# EAGLE design tsc_project (EAGLE 9.7.0)
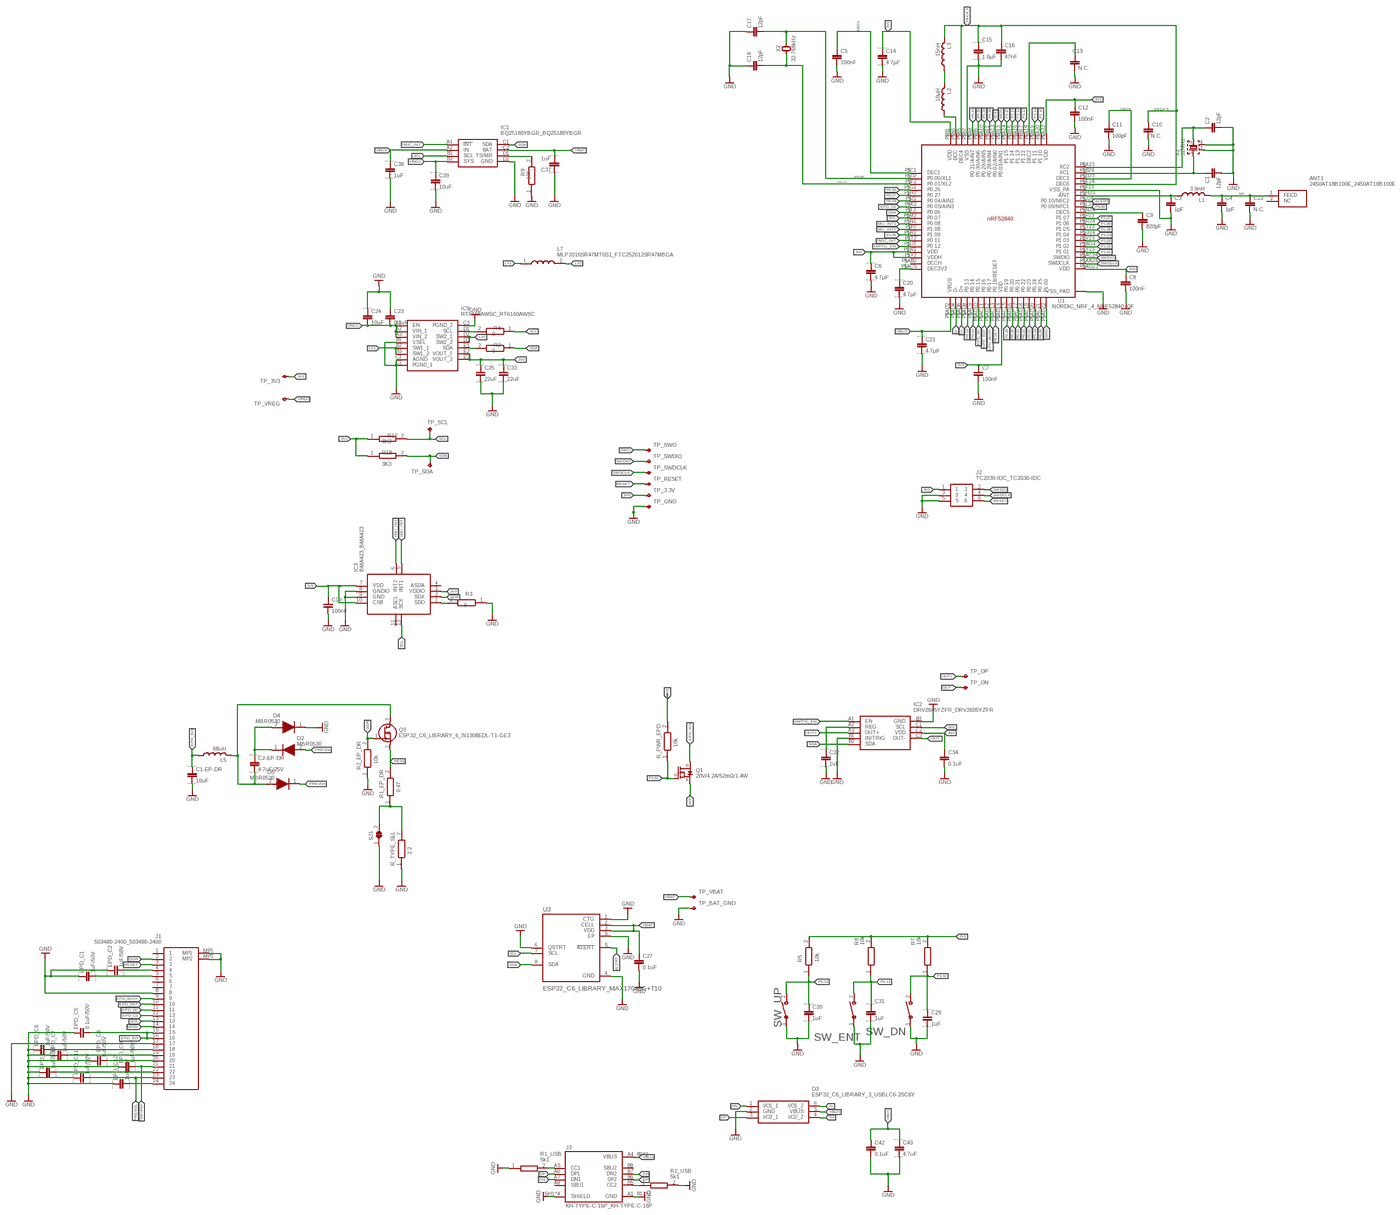
[diagram p0: schematic, sheet 1, overview]
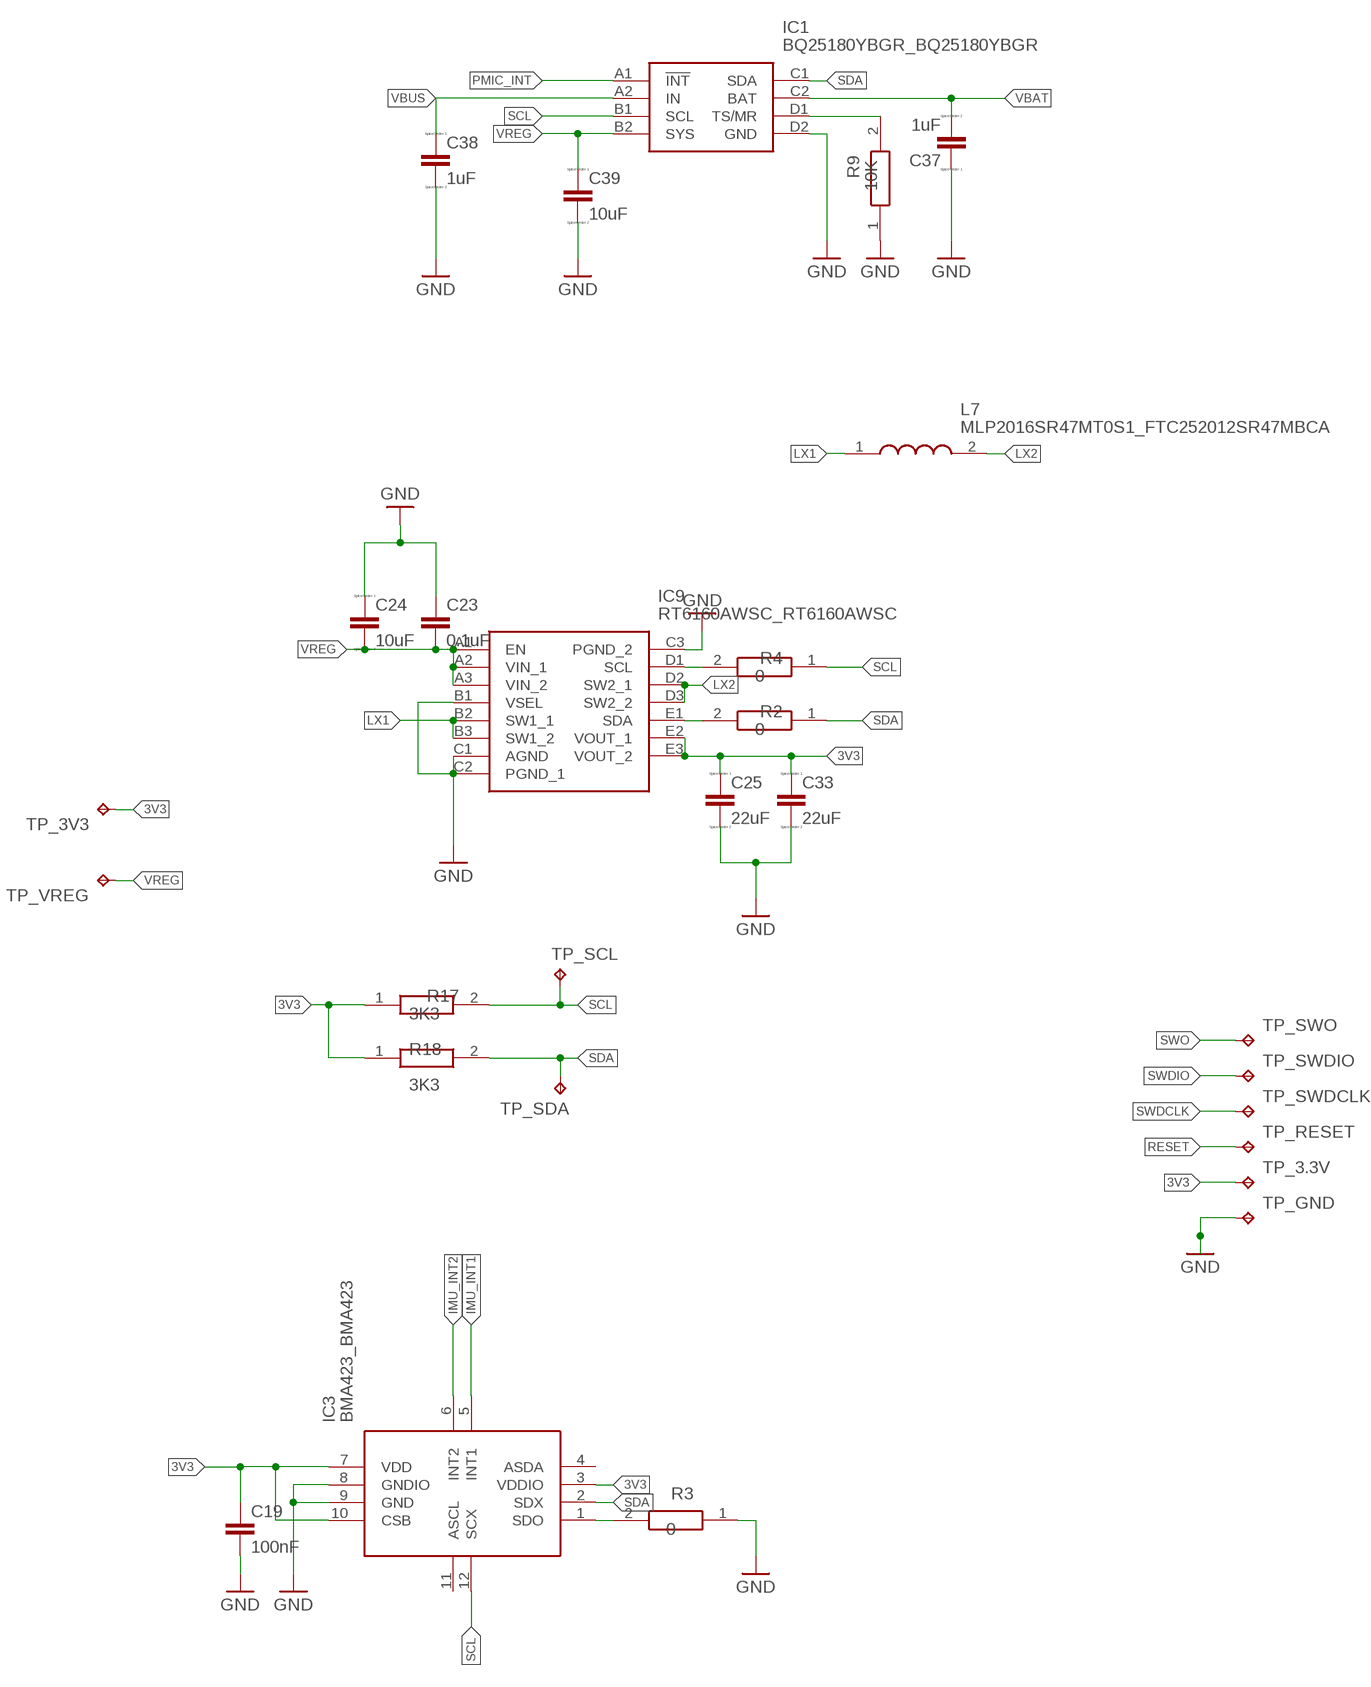
[diagram p1: schematic, sheet 1, part 1 of 4]
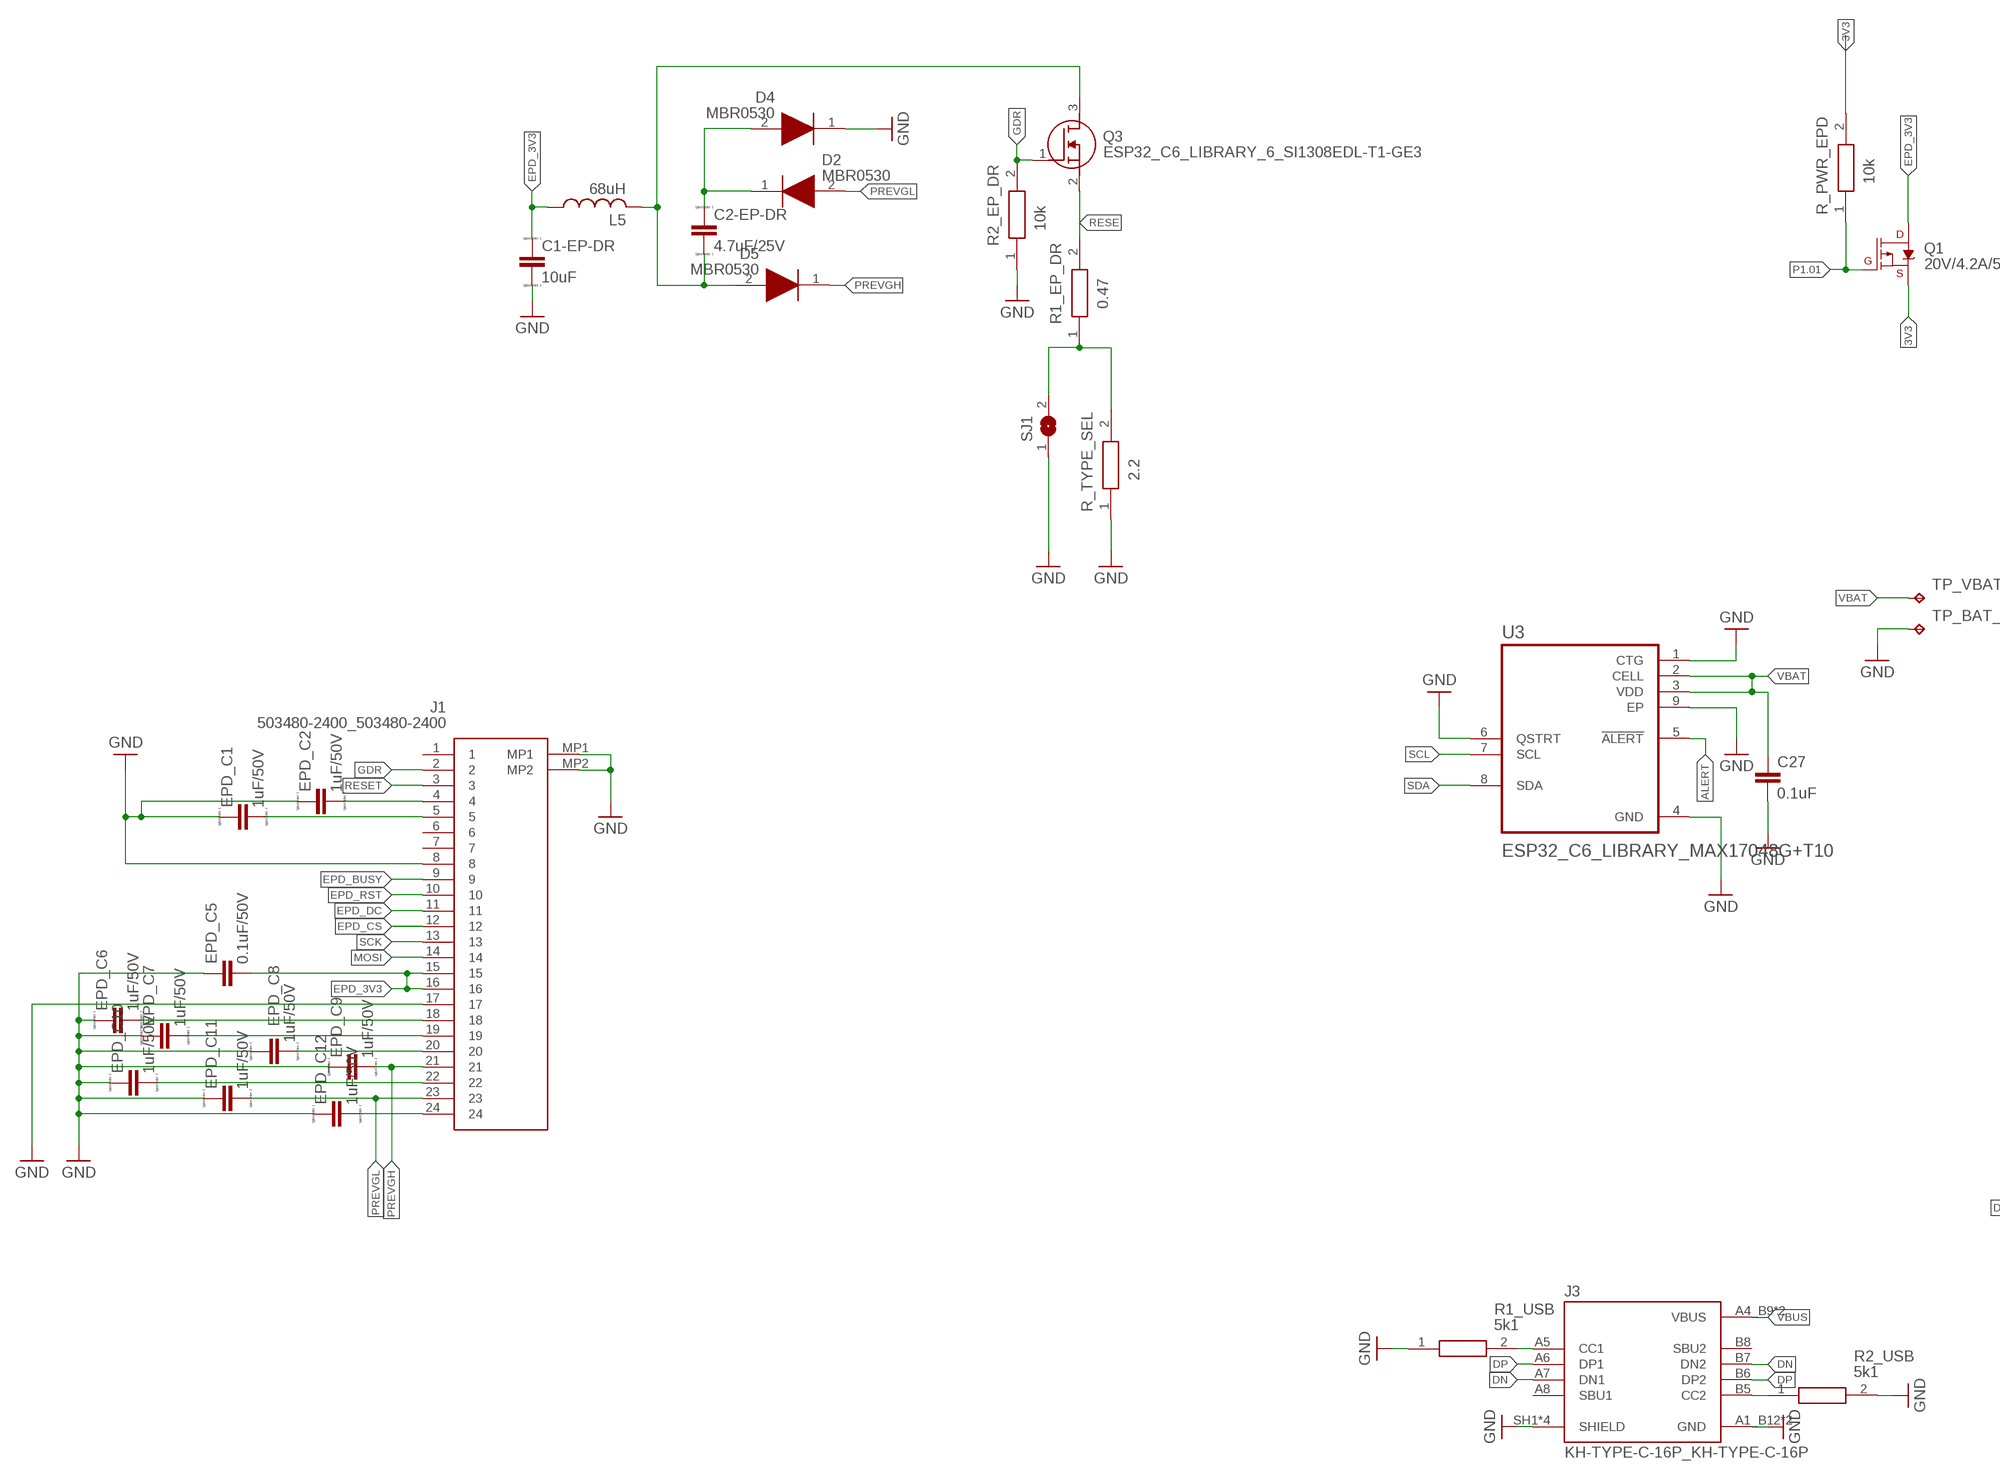
[diagram p2: schematic, sheet 1, part 2 of 4]
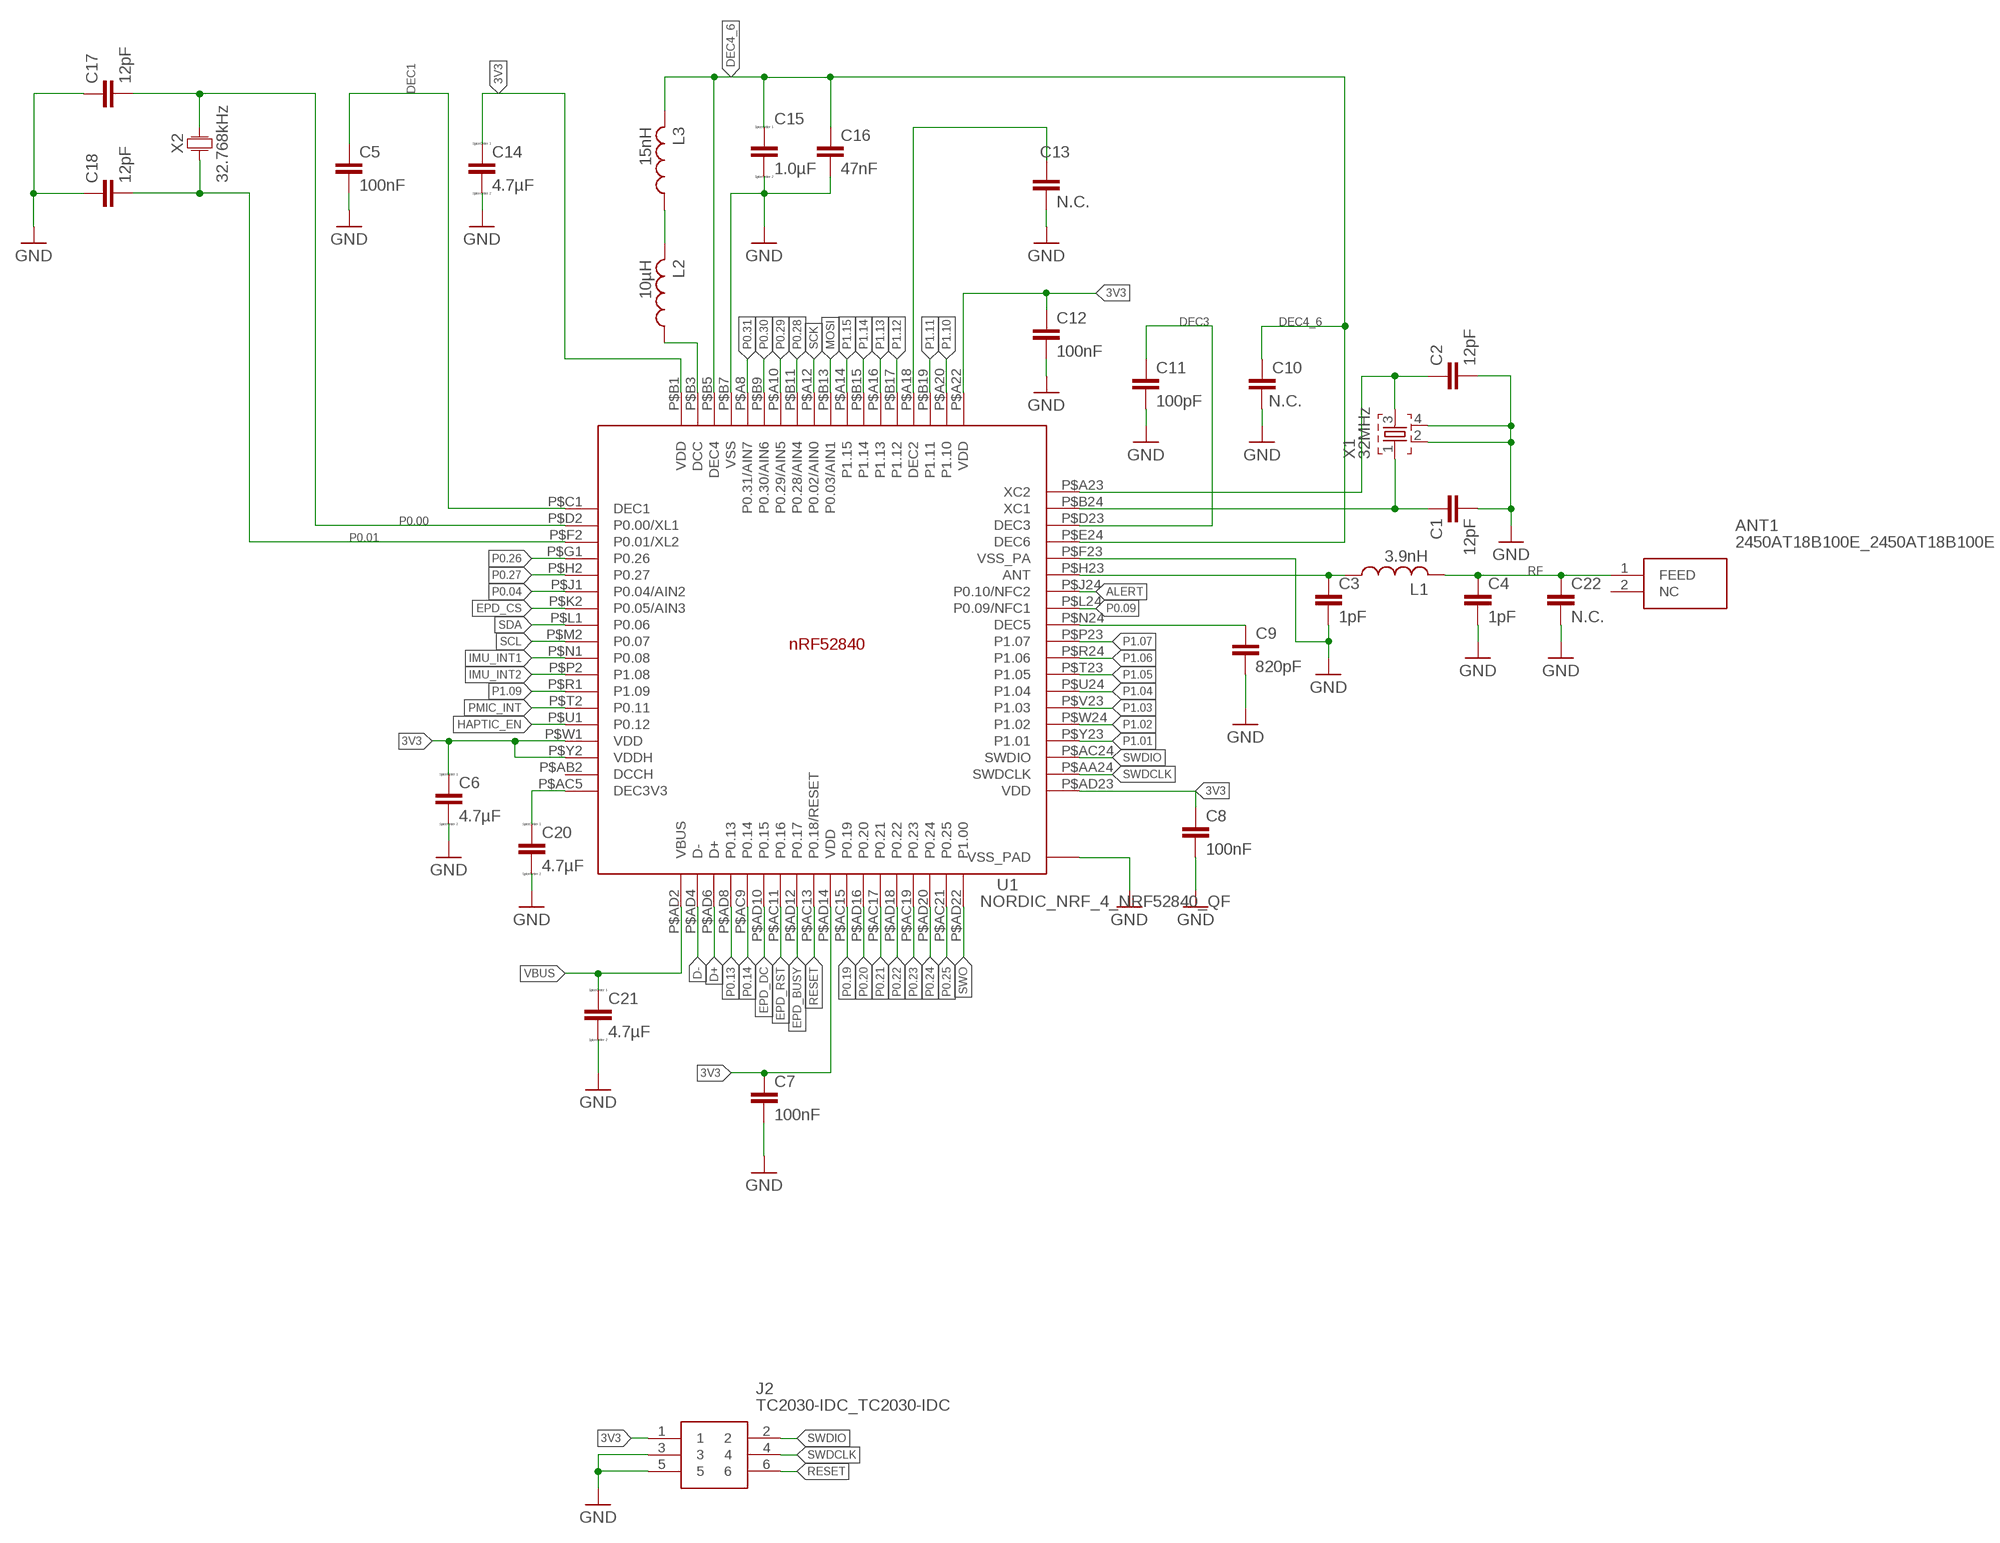
[diagram p3: schematic, sheet 1, part 3 of 4]
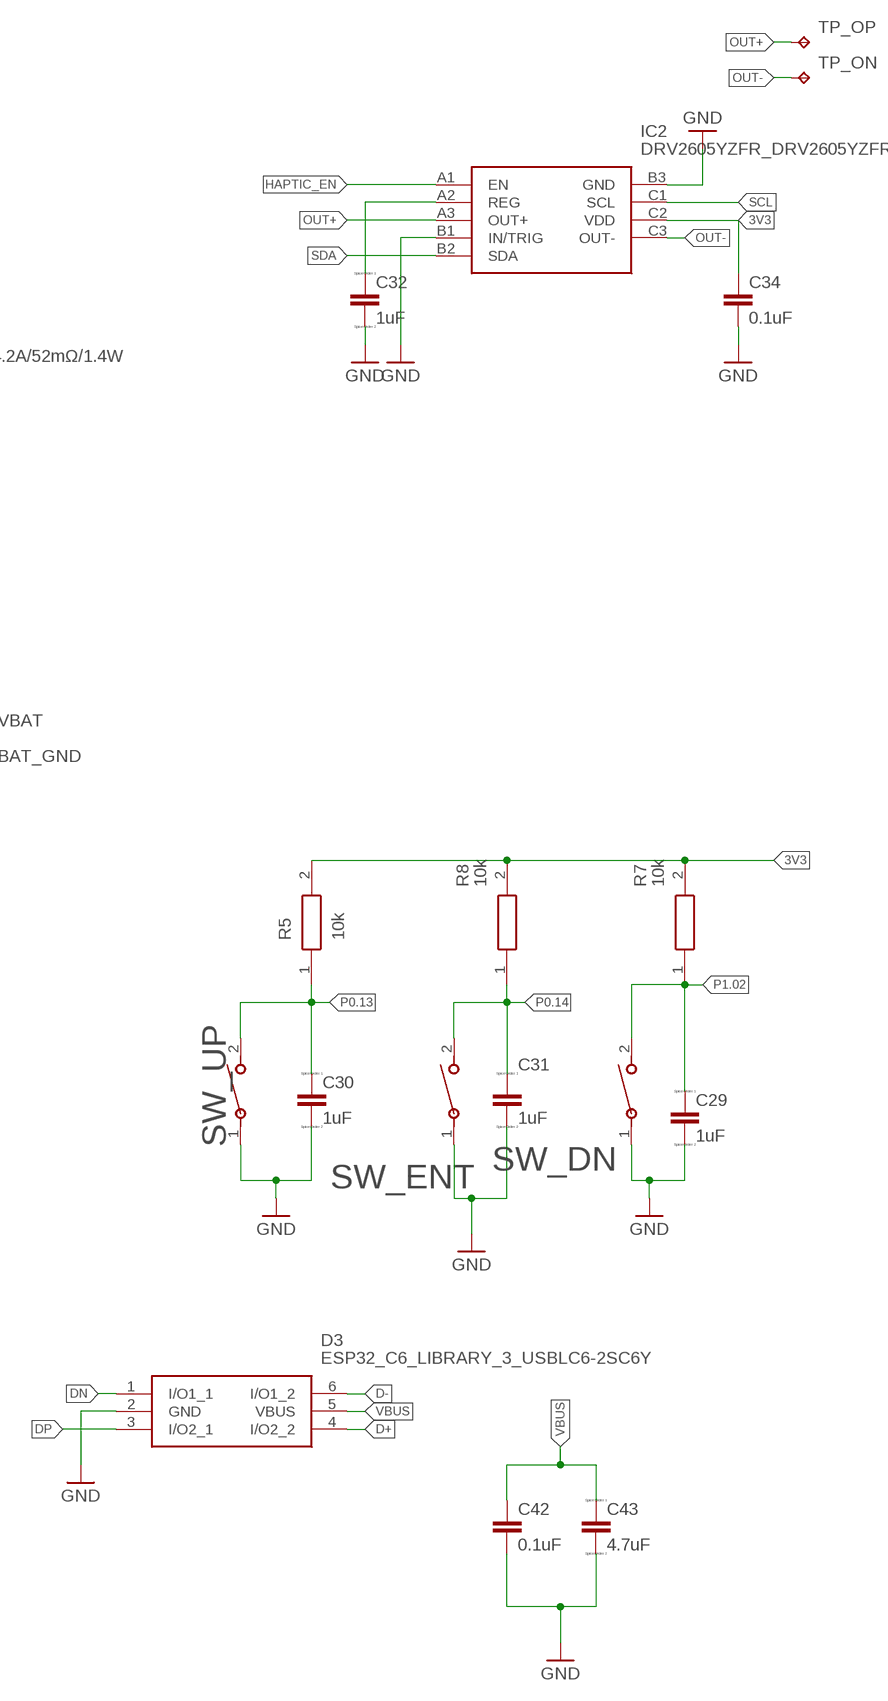
[diagram p4: schematic, sheet 1, part 4 of 4]

## Parts
ANT1  2450AT18B100E_2450AT18B100E  [2450AT18B100E_ANTC3216X140N]
C1  12pF  NORDIC_NRF_3_CAPACITOR_0201_L  [NORDIC_NRF_3_RESC0201_L]
C1-EP-DR  10uF  ESP32_C6_LIBRARY_1_ESP32_WROVER_EAGLE-LTSPICE_CC0402  [ESP32_C6_LIBRARY_1_ESP32_WROVER_EAGLE-LTSPICE_C0402]
C2  12pF  NORDIC_NRF_3_CAPACITOR_0201_L  [NORDIC_NRF_3_RESC0201_L]
C2-EP-DR  4.7uF/25V  ESP32_C6_LIBRARY_1_ESP32_WROVER_EAGLE-LTSPICE_CC0402  [ESP32_C6_LIBRARY_1_ESP32_WROVER_EAGLE-LTSPICE_C0402]
C3  1pF  NORDIC_NRF_3_CAPACITOR_0201_L  [NORDIC_NRF_3_RESC0201_L]
C4  1pF  NORDIC_NRF_3_CAPACITOR_0201_L  [NORDIC_NRF_3_RESC0201_L]
C5  100nF  NORDIC_NRF_3_CAPACITOR_0201_L  [NORDIC_NRF_3_RESC0201_L]
C6  4.7µF  ESP32_C6_LIBRARY_1_ESP32_WROVER_EAGLE-LTSPICE_CC0402  [ESP32_C6_LIBRARY_1_ESP32_WROVER_EAGLE-LTSPICE_C0402]
C7  100nF  NORDIC_NRF_3_CAPACITOR_0201_L  [NORDIC_NRF_3_RESC0201_L]
C8  100nF  NORDIC_NRF_3_CAPACITOR_0201_L  [NORDIC_NRF_3_RESC0201_L]
C9  820pF  NORDIC_NRF_3_CAPACITOR_0201_L  [NORDIC_NRF_3_RESC0201_L]
C10  N.C.  NORDIC_NRF_3_CAPACITOR_0201_L  [NORDIC_NRF_3_RESC0201_L]
C11  100pF  NORDIC_NRF_3_CAPACITOR_0201_L  [NORDIC_NRF_3_RESC0201_L]
C12  100nF  NORDIC_NRF_3_CAPACITOR_0201_L  [NORDIC_NRF_3_RESC0201_L]
C13  N.C.  NORDIC_NRF_3_CAPACITOR_0201_L  [NORDIC_NRF_3_RESC0201_L]
C14  4.7µF  ESP32_C6_LIBRARY_1_ESP32_WROVER_EAGLE-LTSPICE_CC0402  [ESP32_C6_LIBRARY_1_ESP32_WROVER_EAGLE-LTSPICE_C0402]
C15  1.0µF  ESP32_C6_LIBRARY_1_ESP32_WROVER_EAGLE-LTSPICE_CC0402  [ESP32_C6_LIBRARY_1_ESP32_WROVER_EAGLE-LTSPICE_C0402]
C16  47nF  NORDIC_NRF_3_CAPACITOR_0201_L  [NORDIC_NRF_3_RESC0201_L]
C17  12pF  NORDIC_NRF_3_CAPACITOR_0201_L  [NORDIC_NRF_3_RESC0201_L]
C18  12pF  NORDIC_NRF_3_CAPACITOR_0201_L  [NORDIC_NRF_3_RESC0201_L]
C19  100nF  NORDIC_NRF_3_CAPACITOR_0201_L  [NORDIC_NRF_3_RESC0201_L]
C20  4.7µF  ESP32_C6_LIBRARY_1_ESP32_WROVER_EAGLE-LTSPICE_CC0402  [ESP32_C6_LIBRARY_1_ESP32_WROVER_EAGLE-LTSPICE_C0402]
C21  4.7µF  ESP32_C6_LIBRARY_1_ESP32_WROVER_EAGLE-LTSPICE_CC0402  [ESP32_C6_LIBRARY_1_ESP32_WROVER_EAGLE-LTSPICE_C0402]
C22  N.C.  NORDIC_NRF_3_CAPACITOR_0201_L  [NORDIC_NRF_3_RESC0201_L]
C23  0.1uF  NORDIC_NRF_3_CAPACITOR_0201_L  [NORDIC_NRF_3_RESC0201_L]
C24  10uF  ESP32_C6_LIBRARY_1_ESP32_WROVER_EAGLE-LTSPICE_CC0402  [ESP32_C6_LIBRARY_1_ESP32_WROVER_EAGLE-LTSPICE_C0402]
C25  22uF  ESP32_C6_LIBRARY_1_ESP32_WROVER_EAGLE-LTSPICE_CC0402  [ESP32_C6_LIBRARY_1_ESP32_WROVER_EAGLE-LTSPICE_C0402]
C27  0.1uF  NORDIC_NRF_3_CAPACITOR_0201_L  [NORDIC_NRF_3_RESC0201_L]
C29  1uF  ESP32_C6_LIBRARY_1_ESP32_WROVER_EAGLE-LTSPICE_CC0402  [ESP32_C6_LIBRARY_1_ESP32_WROVER_EAGLE-LTSPICE_C0402]
C30  1uF  ESP32_C6_LIBRARY_1_ESP32_WROVER_EAGLE-LTSPICE_CC0402  [ESP32_C6_LIBRARY_1_ESP32_WROVER_EAGLE-LTSPICE_C0402]
C31  1uF  ESP32_C6_LIBRARY_1_ESP32_WROVER_EAGLE-LTSPICE_CC0402  [ESP32_C6_LIBRARY_1_ESP32_WROVER_EAGLE-LTSPICE_C0402]
C32  1uF  ESP32_C6_LIBRARY_1_ESP32_WROVER_EAGLE-LTSPICE_CC0402  [ESP32_C6_LIBRARY_1_ESP32_WROVER_EAGLE-LTSPICE_C0402]
C33  22uF  ESP32_C6_LIBRARY_1_ESP32_WROVER_EAGLE-LTSPICE_CC0402  [ESP32_C6_LIBRARY_1_ESP32_WROVER_EAGLE-LTSPICE_C0402]
C34  0.1uF  NORDIC_NRF_3_CAPACITOR_0201_L  [NORDIC_NRF_3_RESC0201_L]
C37  1uF  ESP32_C6_LIBRARY_1_ESP32_WROVER_EAGLE-LTSPICE_CC0402  [ESP32_C6_LIBRARY_1_ESP32_WROVER_EAGLE-LTSPICE_C0402]
C38  1uF  ESP32_C6_LIBRARY_1_ESP32_WROVER_EAGLE-LTSPICE_CC0402  [ESP32_C6_LIBRARY_1_ESP32_WROVER_EAGLE-LTSPICE_C0402]
C39  10uF  ESP32_C6_LIBRARY_1_ESP32_WROVER_EAGLE-LTSPICE_CC0402  [ESP32_C6_LIBRARY_1_ESP32_WROVER_EAGLE-LTSPICE_C0402]
C42  0.1uF  NORDIC_NRF_3_CAPACITOR_0201_L  [NORDIC_NRF_3_RESC0201_L]
C43  4.7uF  ESP32_C6_LIBRARY_1_ESP32_WROVER_EAGLE-LTSPICE_CC0402  [ESP32_C6_LIBRARY_1_ESP32_WROVER_EAGLE-LTSPICE_C0402]
D2  MBR0530  ESP32_C6_LIBRARY_5_MBR0530  [ESP32_C6_LIBRARY_5_SOD3716X135N]
D3  ESP32_C6_LIBRARY_3_USBLC6-2SC6Y  [ESP32_C6_LIBRARY_3_SOT95P280X145-6N]
D4  MBR0530  ESP32_C6_LIBRARY_5_MBR0530  [ESP32_C6_LIBRARY_5_SOD3716X135N]
D5  MBR0530  ESP32_C6_LIBRARY_5_MBR0530  [ESP32_C6_LIBRARY_5_SOD3716X135N]
EPD_C1  1uF/50V  ESP32_C6_LIBRARY_1_ESP32_WROVER_EAGLE-LTSPICE_CC0402  [ESP32_C6_LIBRARY_1_ESP32_WROVER_EAGLE-LTSPICE_C0402]
EPD_C2  1uF/50V  ESP32_C6_LIBRARY_1_ESP32_WROVER_EAGLE-LTSPICE_CC0402  [ESP32_C6_LIBRARY_1_ESP32_WROVER_EAGLE-LTSPICE_C0402]
EPD_C5  0.1uF/50V  NORDIC_NRF_3_CAPACITOR_0201_L  [NORDIC_NRF_3_RESC0201_L]
EPD_C6  1uF/50V  ESP32_C6_LIBRARY_1_ESP32_WROVER_EAGLE-LTSPICE_CC0402  [ESP32_C6_LIBRARY_1_ESP32_WROVER_EAGLE-LTSPICE_C0402]
EPD_C7  1uF/50V  ESP32_C6_LIBRARY_1_ESP32_WROVER_EAGLE-LTSPICE_CC0402  [ESP32_C6_LIBRARY_1_ESP32_WROVER_EAGLE-LTSPICE_C0402]
EPD_C8  1uF/50V  ESP32_C6_LIBRARY_1_ESP32_WROVER_EAGLE-LTSPICE_CC0402  [ESP32_C6_LIBRARY_1_ESP32_WROVER_EAGLE-LTSPICE_C0402]
EPD_C9  1uF/50V  ESP32_C6_LIBRARY_1_ESP32_WROVER_EAGLE-LTSPICE_CC0402  [ESP32_C6_LIBRARY_1_ESP32_WROVER_EAGLE-LTSPICE_C0402]
EPD_C10  1uF/50V  ESP32_C6_LIBRARY_1_ESP32_WROVER_EAGLE-LTSPICE_CC0402  [ESP32_C6_LIBRARY_1_ESP32_WROVER_EAGLE-LTSPICE_C0402]
EPD_C11  1uF/50V  ESP32_C6_LIBRARY_1_ESP32_WROVER_EAGLE-LTSPICE_CC0402  [ESP32_C6_LIBRARY_1_ESP32_WROVER_EAGLE-LTSPICE_C0402]
EPD_C12  1uF/50V  ESP32_C6_LIBRARY_1_ESP32_WROVER_EAGLE-LTSPICE_CC0402  [ESP32_C6_LIBRARY_1_ESP32_WROVER_EAGLE-LTSPICE_C0402]
IC1  BQ25180YBGR_BQ25180YBGR  [BQ25180YBGR_BGA8C40P2X4_100X155X50]
IC2  DRV2605YZFR_DRV2605YZFR  [DRV2605YZFR_BGA9C50P3X3_144X144X62]
IC3  BMA423_BMA423  [BMA423_BMA423]
IC9  RT6160AWSC_RT6160AWSC  [RT6160AWSC_BGA15C40P3X5_140X230X60]
J1  503480-2400_503480-2400  [503480-2400_5034802400]
J2  TC2030-IDC_TC2030-IDC  [TC2030-IDC_TC2030IDC]
J3  KH-TYPE-C-16P_KH-TYPE-C-16P  [KH-TYPE-C-16P_KINGHELM_KH-TYPE-C-16P]
L1  3.9nH  NORDIC_NRF_2_INDUCTOR_0402_L  [NORDIC_NRF_2_RESC0402_L]
L2  10µH  NORDIC_NRF_2_INDUCTOR_0402_L  [NORDIC_NRF_2_RESC0402_L]
L3  15nH  NORDIC_NRF_2_INDUCTOR_0402_L  [NORDIC_NRF_2_RESC0402_L]
L5  68uH  NORDIC_NRF_2_INDUCTOR_0402_L  [NORDIC_NRF_2_RESC0402_L]
L7  MLP2016SR47MT0S1_FTC252012SR47MBCA  [MLP2016SR47MT0S1_INDC2016X100N]
Q1  20V/4.2A/52mΩ/1.4W  ESP32_C6_LIBRARY_4_ESP32_WROVER_SPARKFUN-DISCRETESEMI_MOSFET_PCH-DMG2305UX-7  [ESP32_C6_LIBRARY_4_ESP32_C6_LIBRARY_4_ESP32_C6_LIBRARY_4_ESP32_C6_LIBRARY_4_ESP32_WROVER_SPARKFUN-DISCRETESEMI_SOT23-3]
Q3  ESP32_C6_LIBRARY_6_SI1308EDL-T1-GE3  [ESP32_C6_LIBRARY_6_SOT65P210X110-3N]
R1_EP_DR  0.47  CPF0201D7K68C1_CPF0201D7K68C1  [CPF0201D7K68C1_0201]
R1_USB  5k1  CPF0201D7K68C1_CPF0201D7K68C1  [CPF0201D7K68C1_0201]
R2  0  ERA-1AEB3401C_CPF0201D7K68C1  [ERA-1AEB3401C_0201]
R2_EP_DR  10k  CPF0201D7K68C1_CPF0201D7K68C1  [CPF0201D7K68C1_0201]
R2_USB  5k1  CPF0201D7K68C1_CPF0201D7K68C1  [CPF0201D7K68C1_0201]
R3  0  CPF0201D7K68C1_CPF0201D7K68C1  [CPF0201D7K68C1_0201]
R4  0  ERA-1AEB3401C_CPF0201D7K68C1  [ERA-1AEB3401C_0201]
R5  10k  CPF0201D7K68C1_CPF0201D7K68C1  [CPF0201D7K68C1_0201]
R7  10k  CPF0201D7K68C1_CPF0201D7K68C1  [CPF0201D7K68C1_0201]
R8  10k  CPF0201D7K68C1_CPF0201D7K68C1  [CPF0201D7K68C1_0201]
R9  10K  CPF0201D7K68C1_CPF0201D7K68C1  [CPF0201D7K68C1_0201]
R17  3K3  ERA-1AEB3401C_CPF0201D7K68C1  [ERA-1AEB3401C_0201]
R18  3K3  ERA-1AEB3401C_CPF0201D7K68C1  [ERA-1AEB3401C_0201]
R_PWR_EPD  10k  ERA-1AEB3401C_CPF0201D7K68C1  [ERA-1AEB3401C_0201]
R_TYPE_SEL  2.2  CPF0201D7K68C1_CPF0201D7K68C1  [CPF0201D7K68C1_0201]
SJ1  ESP32_C6_LIBRARY_7_JUMPER_SJ  [ESP32_C6_LIBRARY_7_JUMPER_SJ]
SW_DN  2025-10-22_07-23-44_LIBRARY_EVP-AKE31ASW_EVP-AKE31A_PAN  [2025-10-22_07-23-44_LIBRARY_SW_EVP-AKE31A_PAN]
SW_ENT  2025-10-22_07-23-44_LIBRARY_EVP-AKE31ASW_EVP-AKE31A_PAN  [2025-10-22_07-23-44_LIBRARY_SW_EVP-AKE31A_PAN]
SW_UP  2025-10-22_07-23-44_LIBRARY_EVP-AKE31ASW_EVP-AKE31A_PAN  [2025-10-22_07-23-44_LIBRARY_SW_EVP-AKE31A_PAN]
TP_3.3V  HECTOR_WATCH_1_TPTP20R  [HECTOR_WATCH_1_TP20R]
TP_3V3  HECTOR_WATCH_1_TPTP20R  [HECTOR_WATCH_1_TP20R]
TP_BAT_GND  HECTOR_WATCH_1_TPTP20R  [HECTOR_WATCH_1_TP20R]
TP_GND  HECTOR_WATCH_1_TPTP20R  [HECTOR_WATCH_1_TP20R]
TP_ON  HECTOR_WATCH_1_TPTP20R  [HECTOR_WATCH_1_TP20R]
TP_OP  HECTOR_WATCH_1_TPTP20R  [HECTOR_WATCH_1_TP20R]
TP_RESET  HECTOR_WATCH_1_TPTP20R  [HECTOR_WATCH_1_TP20R]
TP_SCL  HECTOR_WATCH_1_TPTP20R  [HECTOR_WATCH_1_TP20R]
TP_SDA  HECTOR_WATCH_1_TPTP20R  [HECTOR_WATCH_1_TP20R]
TP_SWDCLK  HECTOR_WATCH_1_TPTP20R  [HECTOR_WATCH_1_TP20R]
TP_SWDIO  HECTOR_WATCH_1_TPTP20R  [HECTOR_WATCH_1_TP20R]
TP_SWO  HECTOR_WATCH_1_TPTP20R  [HECTOR_WATCH_1_TP20R]
TP_VBAT  HECTOR_WATCH_1_TPTP20R  [HECTOR_WATCH_1_TP20R]
TP_VREG  HECTOR_WATCH_1_TPTP20R  [HECTOR_WATCH_1_TP20R]
U1  NORDIC_NRF_4_NRF52840_QF  [NORDIC_NRF_4_AQFN50P700X700X85_HS-74N]
U3  ESP32_C6_LIBRARY_MAX17048G+T10  [ESP32_C6_LIBRARY_SON50P200X200X80-9N]
X1  32MHz  NORDIC_NRF_XTAL_32MHZ  [NORDIC_NRF_BT-XTAL_2016_N]
X2  32.768kHz  9HT10  [XTAL330X1051X90N]

## Nets
3V3 [POWER]: C6.1 C7.1 C8.1 C12.1 C14.1 C19.1 C25.1 C33.1 C34.1 IC2.C2(VDD) IC3.3(VDDIO) IC3.7(VDD) IC3.10(CSB) IC9.E2(VOUT_1) IC9.E3(VOUT_2) J2.1 Q1.2(S) R5.2 R7.2 R8.2 R17.1 R18.1 R_PWR_EPD.2 TP_3.3V.TP TP_3V3.TP U1.P$A22(VDD) U1.P$AD14(VDD) U1.P$AD23(VDD) U1.P$B1(VDD) U1.P$W1(VDD) U1.P$Y2(VDDH)
ALERT: U1.P$J24(P0.10/NFC2) U3.5(!ALERT)
D+: D3.4(I/O2_2) U1.P$AD6(D+)
D-: D3.6(I/O1_2) U1.P$AD4(D-)
DEC1: C5.1 U1.P$C1(DEC1)
DEC3: C11.1 U1.P$D23(DEC3)
DEC4_6: C10.1 C15.1 C16.1 L3.2 U1.P$B5(DEC4) U1.P$E24(DEC6)
DN: D3.1(I/O1_1) J3.A7(DN1) J3.B7(DN2)
DP: D3.3(I/O2_1) J3.A6(DP1) J3.B6(DP2)
EPD_3V3 [POWER]: C1-EP-DR.1 EPD_C5.2 J1.15 J1.16 L5.1 Q1.3(D)
EPD_BUSY: J1.9 U1.P$AD12(P0.17)
EPD_CS: J1.12 U1.P$K2(P0.05/AIN3)
EPD_DC: J1.11 U1.P$AD10(P0.15)
EPD_RST: J1.10 U1.P$AC11(P0.16)
GDR: J1.2 Q3.1(G) R2_EP_DR.2
GND: C1-EP-DR.2 C1.2 C2.2 C3.2 C4.2 C5.2 C6.2 C7.2 C8.2 C9.2 C10.2 C11.2 C12.2 C13.2 C14.2 C15.2 C16.2 C17.1 C18.1 C19.2 C20.2 C21.2 C22.2 C23.1 C24.1 C25.2 C27.2 C29.2 C30.2 C31.2 C32.2 C33.2 C34.2 C37.1 C38.2 C39.2 C42.2 C43.2 D3.2(GND) D4.1(K) EPD_C1.1 EPD_C2.1 EPD_C5.1 EPD_C6.1 EPD_C7.1 EPD_C8.1 EPD_C9.1 EPD_C10.1 EPD_C11.1 EPD_C12.1 IC1.D2(GND) IC2.B1(IN/TRIG) IC2.B3(GND) IC3.8(GNDIO) IC3.9(GND) IC9.B1(VSEL) IC9.C1(AGND) IC9.C2(PGND_1) IC9.C3(PGND_2) J1.8 J1.17 J1.MP1 J1.MP2 J2.3 J2.5 J3.A1_B12(GND) J3.A12_B1(GND) J3.SH1(SHIELD) J3.SH2(SHIELD) J3.SH3(SHIELD) J3.SH4(SHIELD) R1_USB.1 R2_EP_DR.1 R2_USB.2 R3.1 R9.1 R_TYPE_SEL.1 SJ1.1 SW_DN.1 SW_ENT.1 SW_UP.1 TP_BAT_GND.TP TP_GND.TP U1.P$74(VSS_PAD) U1.P$75(VSS_PAD) U1.P$76(VSS_PAD) U1.P$77(VSS_PAD) U1.P$78(VSS_PAD) U1.P$79(VSS_PAD) U1.P$80(VSS_PAD) U1.P$81(VSS_PAD) U1.P$82(VSS_PAD) U1.P$83(VSS_PAD) U1.P$84(VSS_PAD) U1.P$85(VSS_PAD) U1.P$86(VSS_PAD) U1.P$87(VSS_PAD) U1.P$88(VSS_PAD) U1.P$89(VSS_PAD) U1.P$90(VSS_PAD) U1.P$B7(VSS) U1.P$F23(VSS_PA) U3.1(CTG) U3.4(GND) U3.6(QSTRT) U3.9(EP) X1.2 X1.4
HAPTIC_EN: IC2.A1(EN) U1.P$U1(P0.12)
IMU_INT1: IC3.5(INT1) U1.P$N1(P0.08)
IMU_INT2: IC3.6(INT2) U1.P$P2(P1.08)
LX1: IC9.B2(SW1_1) IC9.B3(SW1_2) L7.1
LX2: IC9.D2(SW2_1) IC9.D3(SW2_2) L7.2
MOSI: J1.14 U1.P$B13(P0.03/AIN1)
N$1: IC1.D1(TS/MR) R9.2
N$3: C3.1 L1.1 U1.P$H23(ANT)
N$4: L2.2 L3.1
N$5: IC9.D1(SCL) R4.2
N$6: C1.1 U1.P$B24(XC1) X1.1
N$7: C2.1 U1.P$A23(XC2) X1.3
N$8: IC9.E1(SDA) R2.2
N$9: C20.1 U1.P$AC5(DEC3V3)
N$10: C2-EP-DR.2 D5.2(A) L5.2 Q3.3(D)
N$11: C9.1 U1.P$N24(DEC5)
N$12: C13.1 U1.P$A18(DEC2)
N$13: EPD_C7.2 J1.19
N$15: C2-EP-DR.1 D2.1(K) D4.2(A)
N$17: R1_EP_DR.1 R_TYPE_SEL.2 SJ1.2
N$18: IC3.1(SDO) R3.2
N$19: C32.1 IC2.A2(REG)
N$21: EPD_C2.2 J1.4
N$22: EPD_C1.2 J1.5
N$25: L2.1 U1.P$B3(DCC)
N$33: EPD_C6.2 J1.18
N$34: EPD_C8.2 J1.20
N$37: EPD_C10.2 J1.22
N$39: EPD_C12.2 J1.24
N$41: J3.B5(CC2) R2_USB.1
N$42: J3.A5(CC1) R1_USB.2
OUT+: IC2.A3(OUT+) TP_OP.TP
OUT-: IC2.C3(OUT-) TP_ON.TP
P0.00: C17.2 U1.P$D2(P0.00/XL1) X2.2
P0.01: C18.2 U1.P$F2(P0.01/XL2) X2.1
P0.04: U1.P$J1(P0.04/AIN2)
P0.09: U1.P$L24(P0.09/NFC1)
P0.13: C30.1 R5.1 SW_UP.2 U1.P$AD8(P0.13)
P0.14: C31.1 R8.1 SW_ENT.2 U1.P$AC9(P0.14)
P0.19: U1.P$AC15(P0.19)
P0.20: U1.P$AD16(P0.20)
P0.21: U1.P$AC17(P0.21)
P0.22: U1.P$AD18(P0.22)
P0.23: U1.P$AC19(P0.23)
P0.24: U1.P$AD20(P0.24)
P0.25: U1.P$AC21(P0.25)
P0.26: U1.P$G1(P0.26)
P0.27: U1.P$H2(P0.27)
P0.28: U1.P$B11(P0.28/AIN4)
P0.29: U1.P$A10(P0.29/AIN5)
P0.30: U1.P$B9(P0.30/AIN6)
P0.31: U1.P$A8(P0.31/AIN7)
P1.01: Q1.1(G) R_PWR_EPD.1 U1.P$Y23(P1.01)
P1.02: C29.1 R7.1 SW_DN.2 U1.P$W24(P1.02)
P1.03: U1.P$V23(P1.03)
P1.04: U1.P$U24(P1.04)
P1.05: U1.P$T23(P1.05)
P1.06: U1.P$R24(P1.06)
P1.07: U1.P$P23(P1.07)
P1.09: U1.P$R1(P1.09)
P1.10: U1.P$A20(P1.10)
P1.11: U1.P$B19(P1.11)
P1.12: U1.P$B17(P1.12)
P1.13: U1.P$A16(P1.13)
P1.14: U1.P$B15(P1.14)
P1.15: U1.P$A14(P1.15)
PMIC_INT: IC1.A1(!INT) U1.P$T2(P0.11)
PREVGH: D5.1(K) EPD_C9.2 J1.21
PREVGL: D2.2(A) EPD_C11.2 J1.23
RESE: Q3.2(S) R1_EP_DR.2
RESET: J1.3 J2.6 TP_RESET.TP U1.P$AC13(P0.18/RESET)
RF: ANT1.1(FEED) C4.1 C22.1 L1.2
SCK: J1.13 U1.P$A12(P0.02/AIN0)
SCL: IC1.B1(SCL) IC2.C1(SCL) IC3.12(SCX) R4.1 R17.2 TP_SCL.TP U1.P$M2(P0.07) U3.7(SCL)
SDA: IC1.C1(SDA) IC2.B2(SDA) IC3.2(SDX) R2.1 R18.2 TP_SDA.TP U1.P$L1(P0.06) U3.8(SDA)
SWDCLK: J2.4 TP_SWDCLK.TP U1.P$AA24(SWDCLK)
SWDIO: J2.2 TP_SWDIO.TP U1.P$AC24(SWDIO)
SWO: TP_SWO.TP U1.P$AD22(P1.00)
VBAT [POWER]: C27.1 C37.2 IC1.C2(BAT) TP_VBAT.TP U3.2(CELL) U3.3(VDD)
VBUS [POWER]: C21.1 C38.1 C42.1 C43.1 D3.5(VBUS) IC1.A2(IN) J3.A4_B9(VBUS) J3.A9_B4(VBUS) U1.P$AD2(VBUS)
VREG [POWER]: C23.2 C24.2 C39.1 IC1.B2(SYS) IC9.A1(EN) IC9.A2(VIN_1) IC9.A3(VIN_2) TP_VREG.TP
Unconnected: ANT1.2(NC) IC3.4(ASDA) IC3.11(ASCL) J1.1 J1.6 J1.7 J3.A8(SBU1) J3.B8(SBU2) U1.P$AB2(DCCH)

## Library data of the parts
ANT1 = InkTime_v5:2450AT18B100E_2450AT18B100E: Antennas 2.45GHz ANTENNA Source: Datasheet <https://www.johansontechnology.com/datasheets/2450AT18B100/2450AT18B100.pdf>
C1-C5 C7-C13 C16-C19 C22 C23 C27 C34 C42 EPD_C5 = InkTime_v5:NORDIC_NRF_3_CAPACITOR: Generic chip capacitor
C1-EP-DR C2-EP-DR C6 C14 C15 C20 C21 C24 C25 C29-C33 C37-C39 C43 EPD_C1 EPD_C2 EPD_C6-EPD_C12 = InkTime_v5:ESP32_C6_LIBRARY_1_ESP32_WROVER_EAGLE-LTSPICE_C: CAPACITOR, European symbol
D2 D4 D5 = InkTime_v5:ESP32_C6_LIBRARY_5_MBR0530: ON SEMICONDUCTOR - MBR0530 - DIODE, SCHOTTKY, 0.5A, 30V, SOD-123 Source: Datasheet <http://www.onsemi.com/pub/Collateral/MBR0530T1-D.PDF> Check availability <https://pricing.snapeda.com/parts/MBR0530/ON%20Semiconductor/view-part?ref=eda>
D3 = InkTime_v5:ESP32_C6_LIBRARY_3_USBLC6-2SC6Y: Low Cap. ESD Protection Auto SOT-23-6 STMicroelectronics USBLC6-2SC6Y, Dual Uni-Directional TVS Diode Array, 6-Pin SOT-23 Source: Datasheet <https://componentsearchengine.com/Datasheets/1/USBLC6-2SC6Y.pdf> Check availability <https://pricing.snapeda.com/parts/USBLC6-2SC6Y/STMicroelectronics/view-part?ref=eda>
IC1 = InkTime_v5:BQ25180YBGR_BQ25180YBGR: Charger IC Lithium Ion/Polymer, Lithium Iron Phosphate 8-DSBGA (1.6x1.1) Source: Datasheet <https://www.ti.com/lit/ds/symlink/bq25180.pdf?ts=1650264094470&ref_url=https%3A%2F%2Fwww.ti.com%2Fproduct%2FBQ25180>
IC2 = InkTime_v5:DRV2605YZFR_DRV2605YZFR: Haptic Driver for ERM/LRA with Built-In Library and Smart Loop Architecture Source: Datasheet <http://www.ti.com/lit/gpn/drv2605>
IC3 = InkTime_v5:BMA423_BMA423: Accelerometers Triaxial low-g 12bit Acceleration Sensor Source: Datasheet <https://www.mouser.com/datasheet/2/783/BST-BMA423-DS000-1509600.pdf>
IC9 = InkTime_v5:RT6160AWSC_RT6160AWSC: Buck-Boost Regulator Positive Output Step-Up/Step-Down I2C DC-DC Controller IC 15-WL-CSP (BSC) (1.4x2.3) Source: Datasheet <https://www.richtek.com/SaveDownload.aspx?specid=RT6160A>
J1 = InkTime_v5:503480-2400_503480-2400: FFC & FPC Connectors 0.5mm FPC RA SMT Dual Contact 24Ckt Source: Datasheet <https://componentsearchengine.com/Datasheets/1/503480-2400.pdf>
J2 = InkTime_v5:TC2030-IDC_TC2030-IDC: CABLE ADAPTER 6 POS Source: Datasheet <https://datasheet.datasheetarchive.com/originals/distributors/Datasheets_SAMA/62bc384e093448baaaa63dbd0b9d8707.pdf>
J3 = InkTime_v5:KH-TYPE-C-16P_KH-TYPE-C-16P: Check availability <https://pricing.snapeda.com/parts/KH-TYPE-C-16P/kinghelm/view-part?ref=eda>
L1-L3 L5 = InkTime_v5:NORDIC_NRF_2_INDUCTOR: Generic chip inductor
L7 = InkTime_v5:MLP2016SR47MT0S1_FTC252012SR47MBCA: SMD / SMT Inductors (Coils), L=0.47?H, L x W x T : Source: Datasheet <https://product.tdk.com/system/files/dam/doc/product/inductor/inductor/smd/catalog/inductor_commercial_power_mlp2016_en.pdf>
Q1 = InkTime_v5:ESP32_C6_LIBRARY_4_ESP32_WROVER_SPARKFUN-DISCRETESEMI_MOSFET_PCH: P-channel MOSFETs Voltage controlled devices that allow control of high current outputs. SparkFun Products: SparkFun ESP32 Thing <https://www.sparkfun.com/products/13907> SparkFun ESP8266 Thing <https://www.sparkfun.com/products/13231> SparkFun Pi Servo HAT V2 <https://www.sparkfun.com/products/15316> DMG2305UX-7 (20V/4.2A/SOT23-3)
Q3 = InkTime_v5:ESP32_C6_LIBRARY_6_SI1308EDL-T1-GE3: MOSFET N-Ch 30V 1.5A TrenchFET SC70 Vishay Si1308EDL-T1-GE3 N-channel MOSFET Transistor, 1.5 A, 30 V, 3-Pin SC-70 Source: Datasheet <https://componentsearchengine.com/Datasheets/1/SI1308EDL-T1-GE3.pdf> Check availability <https://pricing.snapeda.com/parts/SI1308EDL-T1-GE3/Vishay%20Siliconix/view-part?ref=eda>
R1_EP_DR R1_USB R2_EP_DR R2_USB R3 R5 R7-R9 R_TYPE_SEL = InkTime_v5:CPF0201D7K68C1_CPF0201D7K68C1: 7.68k 0201 Thin Film Surface Mount Fixed Resistor +/-0.5% 0.031W CPF0201D7K68C1 Source: Datasheet <http://www.te.com/commerce/DocumentDelivery/DDEController?Action=showdoc&DocId=Data Sheet1773200-1ApdfEnglishENG_DS_1773200-1_A.pdf4-2176215-6>
R2 R4 R17 R18 R_PWR_EPD = InkTime_v5:ERA-1AEB3401C_CPF0201D7K68C1: 7.68k 0201 Thin Film Surface Mount Fixed Resistor +/-0.5% 0.031W CPF0201D7K68C1 Source: Datasheet <http://www.te.com/commerce/DocumentDelivery/DDEController?Action=showdoc&DocId=Data Sheet1773200-1ApdfEnglishENG_DS_1773200-1_A.pdf4-2176215-6>
SJ1 = InkTime_v5:ESP32_C6_LIBRARY_7_JUMPER_SJ: SMD solder JUMPER
SW_DN SW_ENT SW_UP = InkTime_v5:2025-10-22_07-23-44_LIBRARY_EVP-AKE31A
TP_3.3V TP_3V3 TP_BAT_GND TP_GND TP_ON TP_OP TP_RESET TP_SCL TP_SDA TP_SWDCLK TP_SWDIO TP_SWO TP_VBAT TP_VREG = InkTime_v5:HECTOR_WATCH_1_TP: Test pad
U1 = InkTime_v5:NORDIC_NRF_4_NRF52840_QF: nRF52840 Features Advanced Single chip 2.4 GHz multi-protocol SoC 32-bit ARM Cortex-M4F Processor 1.7v to 5.5v operation 1MB flash + 256kB RAM Bluetooth 5 support for long range and high throughput 802.15.4 radio support On-chip NFC PPI –Programmable Peripheral Interconnect Automated power management system with automatic power management of each peripheral Configurable I/O mapping for analog and digital I/O 48 x GPIO 1 x QSPI 4 x Master/Slave SPI 2 x Two-wire interface (I²C) I²S interface 2 x UART 4 x PWM USB 2.0 controller ARM TrustZone CryptoCell-310 Cryptographic and security module AES 128-bit ECB/CCM/AAR hardware accelerator Digital microphone interface (PDM) Quadrature decoder 12-bit ADC Low power comparator On-chip 50Ω balun On-air compatible with nRF52, nRF51 and nRF24 Series Applications Advanced high performance wearables Wearables for secure payments Virtual Reality/Augmented Reality systems Smart Home sensor networks Smart city sensor networks High performance HID controllers Internet of Things (IoT) sensor networks Smart door locks Smart lighting networks Connected white goods
U3 = InkTime_v5:ESP32_C6_LIBRARY_MAX17048G+T10: Check availability <https://pricing.snapeda.com/parts/MAX17048G%2BT10/Analog%20Devices/view-part?ref=eda>
X1 = InkTime_v5:NORDIC_NRF_XTAL_32MHZ
X2 = Frequency-Source:9HT10: Crystals 32.768KHz 12.5pF Reference: Datasheet <http://www.txccrystal.com/images/pdf/9ht10.pdf>

## Net classes
1 POWER: width 0.305 mm

## Board
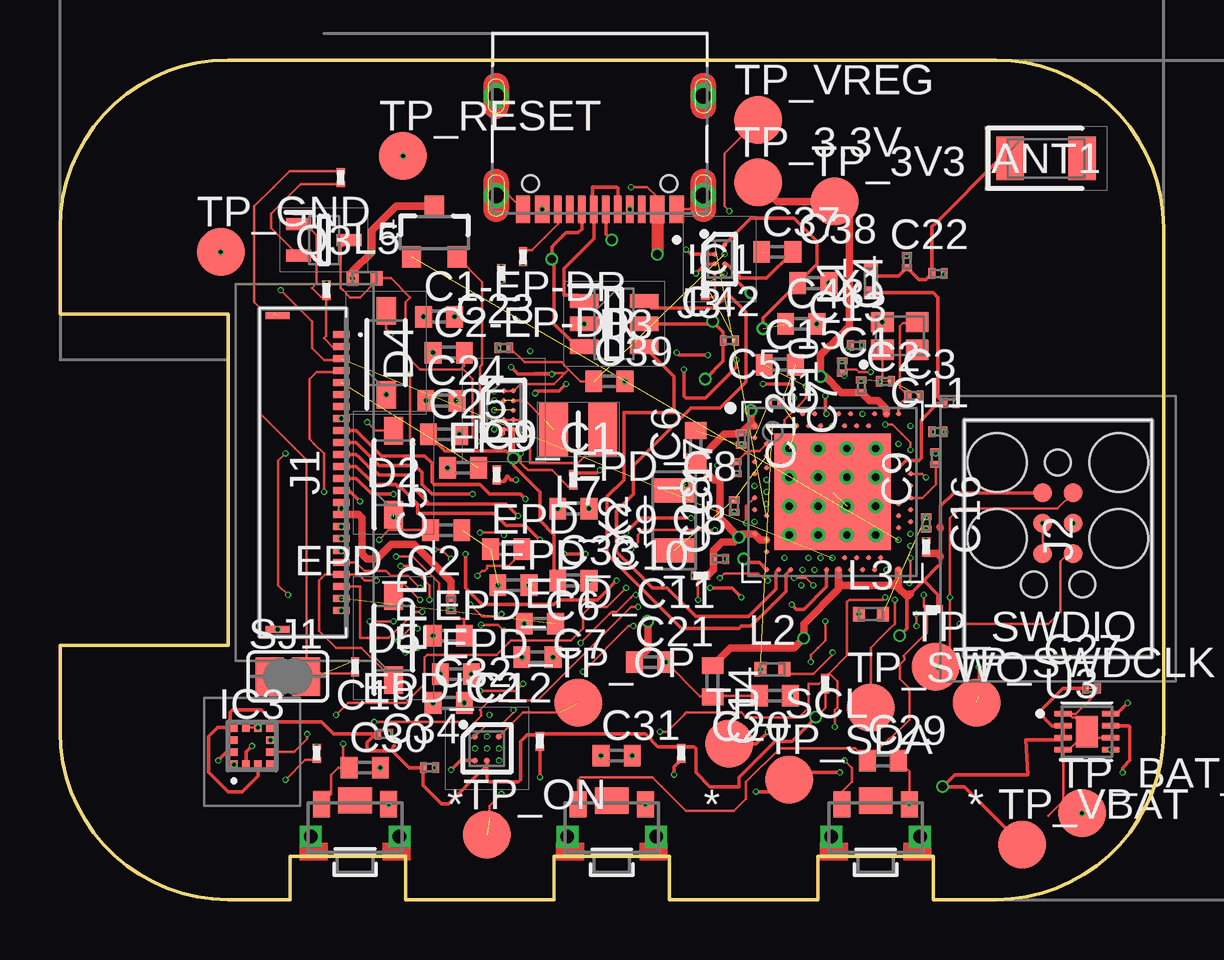
[diagram p5: board, top side]
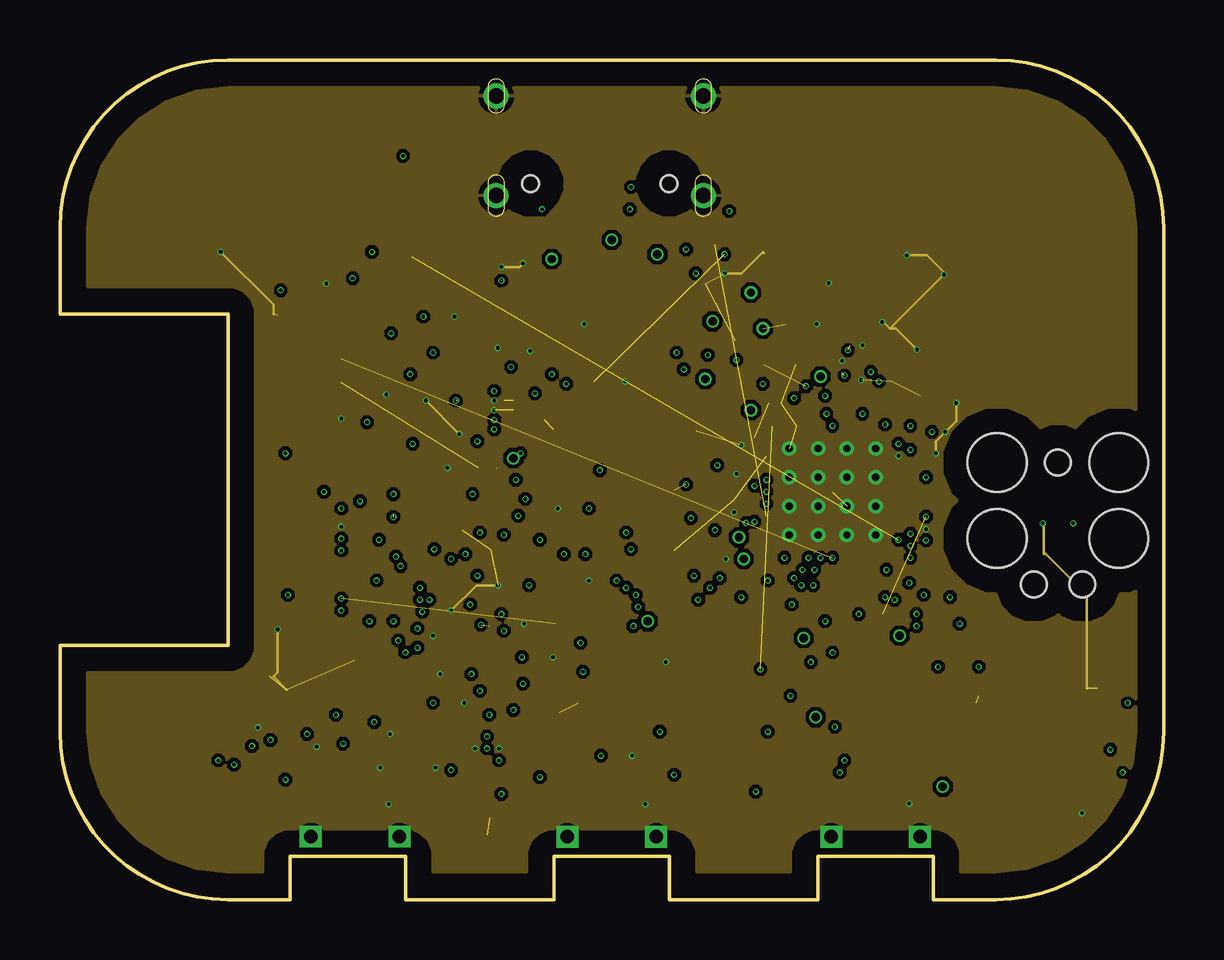
[diagram p6: board, inner layer GND]
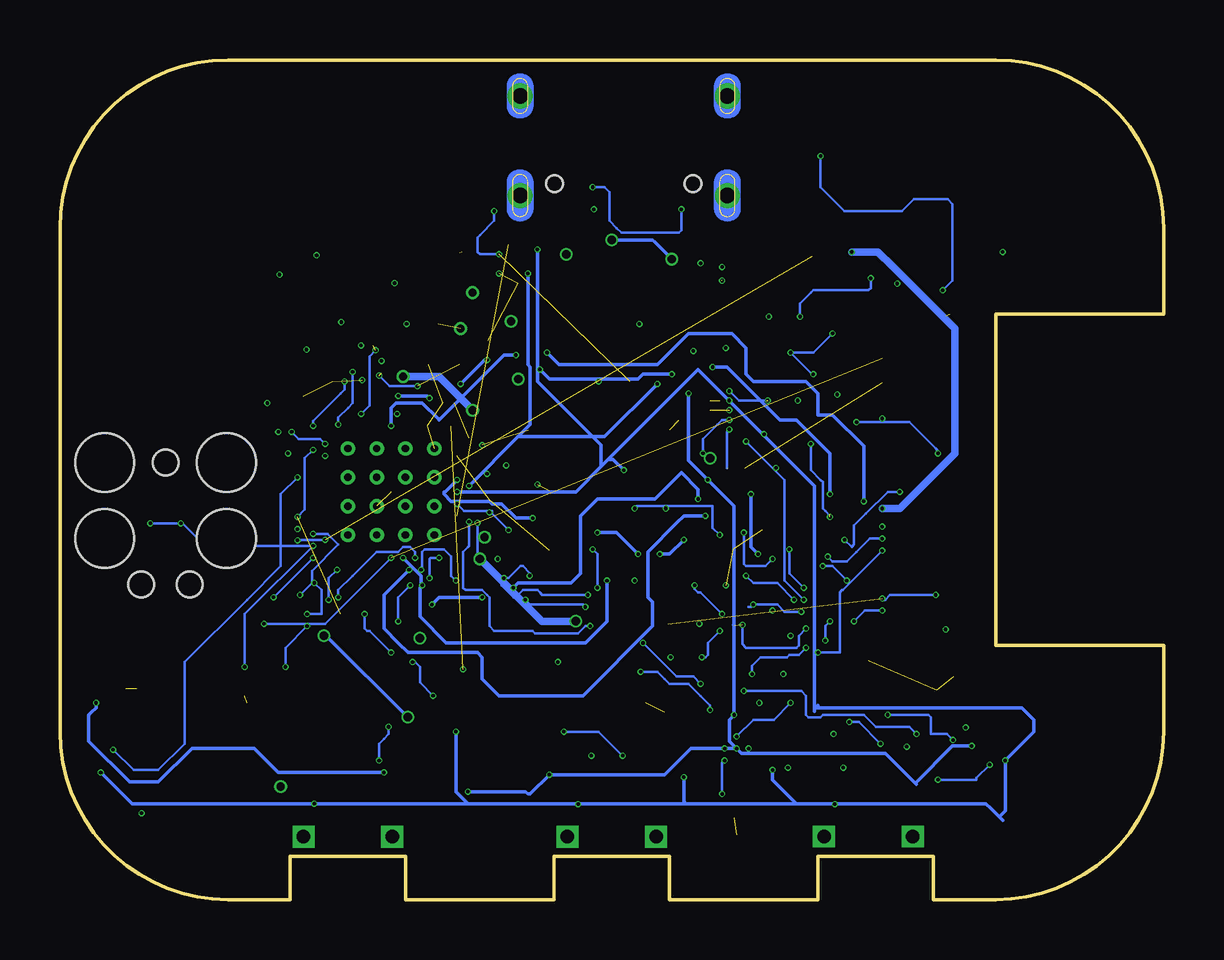
[diagram p7: board, bottom side, seen from below]

Size 46 x 35 mm. Coordinates in mm from the lower left corner, seen from the top.
Outline: 39,0 36.4,0 36.4,1.8 31.6,1.8 31.6,0 25.4,0 25.4,1.8 20.6,1.8 20.6,0 14.4,0 14.4,1.8 9.6,1.8 9.6,0 7,0 arc-90 0,7 0,10.6 7,10.6 7,24.4 0,24.4 0,28 arc-90 7,35 39,35 arc-90 46,28 46,7 arc-90 39,0
Copper layers (1+2*63+16): Top / GND / Bottom / layer 63
Stack-up 4 Layer Stack: Top SilkScreen Epoxy Ink / Top SolderMask SR:Green 0.0254mm Dk 4.3 / Top Surface Finish Lead-Free 0.02mm / Top CuFoil:007 0.035mm / Dielectric-1 Prepreg:001 0.064mm / Dielectric-2 Prepreg:001 0.064mm / GND CuFoil:007 0.035mm / Dielectric-3 User Defined 0.5132mm / Power CuFoil:007 0.035mm / Dielectric-4 Prepreg:001 0.064mm / Dielectric-5 Prepreg:001 0.064mm / Bottom CuFoil:007 0.035mm / Bottom Surface Finish Lead-Free 0.02mm / Bottom SolderMask SR:Green 0.0254mm Dk 4.3 / Bottom SilkScreen Epoxy Ink
Design rules: minimum copper width classes=1 12mil, minimum copper width 0.1mm, minimum drill size 0.1mm, copper clearance wire_polygon to wire_polygon 6mil, copper clearance wire_polygon to pad_smd 6mil, copper clearance wire_polygon to via 6mil, copper clearance pad_smd to pad_smd 0.1mm, copper clearance pad_smd to via 0.1mm, copper clearance via to via 6mil, copper clearance smd to pad (same net) 0.1mm, copper clearance smd to via (same net) 6mil, copper clearance smd to smd (same net) 6mil, dimension clearance 40mil, via restrict clearance 0mil, restrict clearance 0mil, solder-mask clearance 4mil, drill distance 0.1mm, keepout clearance 0mil

### Footprints (pad centres in the part's own frame; a part is rotated, then mirrored left to right if it is on the bottom)
2450AT18B100E_ANTC3216X140N = smd 1.15 x 1.8: 1 -1.5,0; 2 1.5,0
NORDIC_NRF_3_RESC0201_L = smd 0.28 x 0.43: 1 -0.255,0; 2 0.255,0
ESP32_C6_LIBRARY_1_ESP32_WROVER_EAGLE-LTSPICE_C0402 = smd 0.7 x 0.9: 1 -0.65,0; 2 0.65,0
ESP32_C6_LIBRARY_5_SOD3716X135N = smd 1.15 x 0.8: 1 -1.75,0; 2 1.75,0
ESP32_C6_LIBRARY_3_SOT95P280X145-6N = smd 1.2 x 0.6: 1 -1.25,0.95; 2 -1.25,0; 3 -1.25,-0.95; 4 1.25,-0.95; 5 1.25,0; 6 1.25,0.95
BQ25180YBGR_BGA8C40P2X4_100X155X50 = smd 0.2 x 0.2: A1 -0.2,0.6; A2 0.2,0.6; B1 -0.2,0.2; B2 0.2,0.2; C1 -0.2,-0.2; C2 0.2,-0.2; D1 -0.2,-0.6; D2 0.2,-0.6
DRV2605YZFR_BGA9C50P3X3_144X144X62 = smd 0.25 x 0.25: A1 -0.5,0.5; A2 0,0.5; A3 0.5,0.5; B1 -0.5,0; B2 0,0; B3 0.5,0; C1 -0.5,-0.5; C2 0,-0.5; C3 0.5,-0.5
BMA423_BMA423 = smd 0.3 x 0.35: 1 -0.75,-0.775; 2 -0.25,-0.775; 3 0.25,-0.775; 4 0.75,-0.775; 7 0.75,0.775; 8 0.25,0.775; 9 -0.25,0.775; 10 -0.75,0.775 | smd 0.35 x 0.3: 5 0.775,-0.25; 6 0.775,0.25; 11 -0.775,0.25; 12 -0.775,-0.25
RT6160AWSC_BGA15C40P3X5_140X230X60 = smd 0.216 x 0.216: A1 -0.4,0.8; A2 0,0.8; A3 0.4,0.8; B1 -0.4,0.4; B2 0,0.4; B3 0.4,0.4; C1 -0.4,0; C2 0,0; C3 0.4,0; D1 -0.4,-0.4; D2 0,-0.4; D3 0.4,-0.4; E1 -0.4,-0.8; E2 0,-0.8; E3 0.4,-0.8
503480-2400_5034802400 = smd 0.3 x 0.7: 1 -5.75,1.525; 2 -5.25,1.525; 3 -4.75,1.525; 4 -4.25,1.525; 5 -3.75,1.525; 6 -3.25,1.525; 7 -2.75,1.525; 8 -2.25,1.525; 9 -1.75,1.525; 10 -1.25,1.525; 11 -0.75,1.525; 12 -0.25,1.525; 13 0.25,1.525; 14 0.75,1.525; 15 1.25,1.525; 16 1.75,1.525; 17 2.25,1.525; 18 2.75,1.525; 19 3.25,1.525; 20 3.75,1.525; 21 4.25,1.525; 22 4.75,1.525; 23 5.25,1.525; 24 5.75,1.525 | smd 0.3 x 1: MP1 -6.54,-1.125; MP2 6.54,-1.125
TC2030-IDC_TC2030IDC = smd 0.783 x 0.783: 1 -0.953,-0.635; 2 -0.953,0.635; 3 0.317,-0.635; 4 0.317,0.635; 5 1.588,-0.635; 6 1.588,0.635 | hole 2.451: -2.223,-2.54; -2.223,2.54; 0.952,-2.54; 0.952,2.54 | hole 1.067: -2.223,0; 2.857,-1.016; 2.857,1.016
KH-TYPE-C-16P_KINGHELM_KH-TYPE-C-16P = smd 0.6 x 1.15: A1_B12 -3.2,4.725; A4_B9 -2.4,4.725; A9_B4 2.4,4.725; A12_B1 3.2,4.725 | smd 0.3 x 1.15: A5 -1.25,4.725; A6 -0.25,4.725; A7 0.25,4.725; A8 1.25,4.725; B5 1.75,4.725; B6 0.75,4.725; B7 -0.75,4.725; B8 -1.75,4.725 | drill 0.65 pad 1.05: SH1 -4.32,0; SH2 4.32,0; SH3 -4.32,4.15; SH4 4.32,4.15 | hole 0.7: -2.89,3.65; 2.89,3.65
NORDIC_NRF_2_RESC0402_L = smd 0.5 x 0.6: 1 -0.5,0; 2 0.5,0
MLP2016SR47MT0S1_INDC2016X100N = smd 1.2 x 2.2: 1 -1.028,0; 2 1.028,0
ESP32_C6_LIBRARY_4_ESP32_C6_LIBRARY_4_ESP32_C6_LIBRARY_4_ESP32_C6_LIBRARY_4_ESP32_WROVER_SPARKFUN-DISCRETESEMI_SOT23-3 = smd 0.8 x 0.9: 1 -0.95,-1; 2 0.95,-1; 3 0,1.1
ESP32_C6_LIBRARY_6_SOT65P210X110-3N = smd 1.05 x 0.5: 1 -1.05,0.65; 2 -1.05,-0.65; 3 1.05,0
CPF0201D7K68C1_0201 = smd 0.35 x 0.25: 1 0,0.275; 2 0,-0.275
ERA-1AEB3401C_0201 = smd 0.35 x 0.25: 1 0,0.275; 2 0,-0.275
ESP32_C6_LIBRARY_7_JUMPER_SJ = smd 1.168 x 1.6: 1 -0.762,0; 2 0.762,0
2025-10-22_07-23-44_LIBRARY_SW_EVP-AKE31A_PAN = smd 0.711 x 1.092: 1 -1.4,-0.972; 2 1.4,-0.972 | drill 0.559 pad 0.914 square: 3 -1.848,0.381; 4 1.848,0.381 | smd 1.397 x 1.092: 5 0,-1.124
HECTOR_WATCH_1_TP20R = smd 2 x 2: TP 0,0
NORDIC_NRF_4_AQFN50P700X700X85_HS-74N = smd 4.85 x 4.85: P$74 0,0 | drill 0.3 pad 0.6: P$75 -1.8,1.8; P$76 -0.6,1.8; P$77 0.6,1.8; P$78 1.8,1.8; P$79 -1.8,0.6; P$80 -0.6,0.6; P$81 0.6,0.6; P$82 1.8,0.6; P$83 -1.8,-0.6; P$84 -0.6,-0.6; P$85 0.6,-0.6; P$86 1.8,-0.6; P$87 -1.8,-1.8; P$88 -0.6,-1.8; P$89 0.6,-1.8; P$90 1.8,-1.8 | smd 0.2 x 0.2: P$A8 -1.25,3.25; P$A10 -0.75,3.25; P$A12 -0.25,3.25; P$A14 0.25,3.25; P$A16 0.75,3.25; P$A18 1.25,3.25; P$A20 1.75,3.25; P$A22 2.25,3.25; P$A23 2.75,3.25; P$AA24 3.25,-2.25; P$AB2 -2.75,-2.5; P$AC5 -2,-2.75; P$AC9 -1,-2.75; P$AC11 -0.5,-2.75; P$AC13 0,-2.75; P$AC15 0.5,-2.75; P$AC17 1,-2.75; P$AC19 1.5,-2.75; P$AC21 2,-2.75; P$AC24 3.25,-2.75; P$AD2 -2.75,-3.25; P$AD4 -2.25,-3.25; P$AD6 -1.75,-3.25; P$AD8 -1.25,-3.25; P$AD10 -0.75,-3.25; P$AD12 -0.25,-3.25; P$AD14 0.25,-3.25; P$AD16 0.75,-3.25; P$AD18 1.25,-3.25; P$AD20 1.75,-3.25; P$AD22 2.25,-3.25; P$AD23 2.75,-3.25; P$B1 -3.25,2.75; P$B3 -2.5,2.75; P$B5 -2,2.75; P$B7 -1.5,2.75; P$B9 -1,2.75; P$B11 -0.5,2.75; P$B13 0,2.75; P$B15 0.5,2.75; P$B17 1,2.75; P$B19 1.5,2.75; P$B24 3.25,2.75; P$C1 -3.25,2.25; P$D2 -2.75,2; P$D23 2.75,2; P$E24 3.25,1.75; P$F2 -2.75,1.5; P$F23 2.75,1.5; P$G1 -3.25,1.25; P$H2 -2.75,1; P$H23 2.75,1; P$J1 -3.25,0.75; P$J24 3.25,0.75; P$K2 -2.75,0.5; P$L1 -3.25,0.25; P$L24 3.25,0.25; P$M2 -2.75,0; P$N1 -3.25,-0.25; P$N24 3.25,-0.25; P$P2 -2.75,-0.5; P$P23 2.75,-0.5; P$R1 -3.25,-0.75; P$R24 3.25,-0.75; P$T2 -2.75,-1; P$T23 2.75,-1; P$U1 -3.25,-1.25; P$U24 3.25,-1.25; P$V23 2.75,-1.5; P$W1 -3.25,-1.75; P$W24 3.25,-1.75; P$Y2 -2.75,-2; P$Y23 2.75,-2
ESP32_C6_LIBRARY_SON50P200X200X80-9N = smd 0.76 x 0.27: 1 -0.985,0.75; 2 -0.985,0.25; 3 -0.985,-0.25; 4 -0.985,-0.75; 5 0.985,-0.75; 6 0.985,-0.25; 7 0.985,0.25; 8 0.985,0.75 | smd 0.9 x 1.3: 9 0,0
NORDIC_NRF_BT-XTAL_2016_N = smd 0.95 x 0.85: 1 -0.725,-0.575; 2 0.725,-0.575; 3 0.725,0.575; 4 -0.725,0.575
XTAL330X1051X90N = smd 1 x 1.8: 1 -1.25,0; 2 1.25,0

### Placement (x,y rotation side)
ANT1  41.1,30.9 0 top
C1  34.4,21.6 0 top
C1-EP-DR  15.8,24.3 0 top
C2  35.6,21 0 top
C2-EP-DR  16.2,22.8 0 top
C3  37.1,20.7 0 top
C4  35.3,26.6 90 top
C5  29.8,20.7 0 top
C6  26.5,18.9 90 top
C7  33.4,21.4 90 top
C8  27.5,14.2 0 top
C9  36.5,18.4 90 top
C10  32.6,22.2 90 top
C11  36.6,19.5 0 top
C12  28.4,19.2 270 top
C13  33.2,23.1 0 top
C14  27.2,9.1 270 top
C15  30,22.3 0 top
C16  36.1,15.7 270 top
C17  28.2,18 90 top
C18  28.1,16.4 90 top
C19  13.5,6.9 0 top
C20  29.8,8.5 180 top
C21  24.6,9.9 0 top
C22  36.6,26.1 0 top
C23  18.5,23 0 top
C24  15.9,20.8 0 top
C25  16,19.4 0 top
C27  43,8.8 0 top
C29  34.3,5.8 0 top
C30  12.7,5.5 0 top
C31  23.2,6 0 top
C32  16.2,8.2 0 top
C33  21.4,13.3 0 top
C34  15.4,5.5 0 top
C37  29.9,27 0 top
C38  31.4,25.7 0 top
C39  22.9,21.6 0 top
C42  27.9,23.3 0 top
C43  30.9,24 0 top
D2  13.9,17.8 90 top
D3  23.1,24 0 top
D4  13.6,22.8 90 top
D5  13.9,10.9 90 top
EPD_C1  16.8,18 0 top
EPD_C2  16.1,15.4 180 top
EPD_C5  16.3,12.3 90 top
EPD_C6  16.2,11 0 top
EPD_C7  16.5,9.4 0 top
EPD_C8  21.4,16.3 0 top
EPD_C9  18.6,14.6 0 top
EPD_C10  18.9,13.1 0 top
EPD_C11  20,11.5 0 top
EPD_C12  19.9,10.1 180 top
IC1  27.5,26.7 0 top
IC2  17.8,6.3 0 top
IC3  8,6.4 0 top
IC9  18.5,20.4 0 top
J1  10.2,17.8 270 top
J2  41.6,16 270 top
J3  22.5,33.5 180 top
L1  33.8,25.8 90 top
L2  29.7,9.6 0 top
L3  33.8,11.9 0 top
L5  12.7,25.9 0 top
L7  21.6,19.6 0 top
Q1  15.6,27.8 0 top
Q3  11,27.5 0 top
R1_EP_DR  11.7,30.1 0 top
R1_USB  18.4,26.1 0 top
R2  18.2,17.7 180 top
R2_EP_DR  11.1,25.4 0 top
R2_USB  19.3,26.8 0 top
R3  10.7,6.1 0 top
R4  21.4,17.5 0 top
R5  26.7,13.5 90 top
R7  36.4,12.1 90 top
R8  31.9,9 0 top
R9  26.9,25.4 0 top
R17  20,6.6 0 top
R18  25.9,6.1 0 top
R_PWR_EPD  36.1,14.7 0 top
R_TYPE_SEL  12.3,9.7 0 top
SJ1  9.5,9.3 0 top
SW_DN  23,3 180 top
SW_ENT  34,3 180 top
SW_UP  12.3,3.01 180 top
TP_3.3V  29.1,29.9 0 top
TP_3V3  32.3,29.1 0 top
TP_BAT_GND  42.6,3.6 0 top
TP_GND  6.7,27 0 top
TP_ON  17.8,2.7 0 top
TP_OP  21.6,8.2 0 top
TP_RESET  14.3,31 0 top
TP_SCL  27.9,6.5 0 top
TP_SDA  30.4,5 0 top
TP_SWDCLK  38.2,8.2 0 top
TP_SWDIO  36.5,9.7 0 top
TP_SWO  33.8,8 0 top
TP_VBAT  40.1,2.3 0 top
TP_VREG  29.1,32.5 0 top
U1  32.2,17 0 top
U3  42.8,7 0 top
X1  35,23.5 0 top
X2  25.6,15.8 90 top

### Tracks (layer width: path | path; a pad name or v marks a point on that pad's centre or on a via)
3V3  (via drill 0.35)
  Top 0.1: Q1.2 17.6,25.75 17.6,22.3 17.5,22.2 17.5,19.5 17.8,19.2 17.9,19.2 18.1,19.2 18.2,19.1 18.5,19.4 IC9.E2 | R8.2 31.9,8 v31.5,7.6
  Top 0.152: IC9.E2 IC9.E3 v18.9,18.4 | v35,11 35.3,11.3 35.3,12.6 35.45,12.75 35.55,12.85 36,13.3 | 36,13.3 36.6,13.9 36.7,14 36.7,14.3 36.7,15.5 36.7,16.4 37.25,16.95 J2.1 | v18.9,18.4 18.6,18.7 16.05,18.7 C25.1 | v18.9,18.4 18.9,18.1 20,17 20,15.8 20.6,15.2 20.6,13.45 C33.1 | v31.5,7.6 30.5,6.6 29.8,6.6 28.3,5.1 28.3,4.7 27.1,4.7 26.5,5.3 26.5,6.3 26.43,6.38 R18.1 24.93,6.38 24.4,6.9 20.02,6.9 R17.1 19.48,6.88 19.4,6.8 19.2,6.6 19.2,5 19.1,4.9 17.9,4.9 17.8,5 IC2.C2 17.8,5.6 17.1,4.9 16.7,4.5 16.2,4 15.9,4 15.14,4.76 C34.1 14.54,5.5 13.79,6.25 | 13.9,6.4 13.95,6.4 13.79,6.25 | 13.79,6.25 13.74,6.2 12.8,6.2 12.8,6.55 13.2,6.96 13.2,6.95 C19.1 11.4,6.9 10.9,7.4 8.97,7.4 IC3.7 8.75,7.55 8.4,7.9 7.2,7.9 7.1,7.8 7.1,7.32 IC3.10 6.57,7.18 6.2,6.8 6.2,5.3 7,4.5 7.6,4.5 8.1,5 8.25,5.15 IC3.3 | 36,13.3 36.6,12.7 36.6,12.18 R7.2
  Top 0.305: 34.95,13.3 U1.P$AD23 34.95,13 | 34.95,13.3 34.95,13 | 34.95,13 35.3,12.65 | 35.35,12.65 35.3,12.65 | 36.7,14.3 36.58,14.43 36.3,14.43 R_PWR_EPD.2 | 36.67,15.53 36.7,15.5 | 34.95,13.3 34.75,13.1 33.4,13.1 32.6,13.1 32.5,13.2 32.45,13.25 U1.P$AD14 32.45,12.95 31,11.5 v31,10.9 30.65,10.55 30.6,10.5 28.3,10.5 27.95,10.5 C14.1 | v28.3,15.1 28.1,14.9 27.6,14.9 27.25,14.54 C8.1 27.25,13.77 R5.2 | U1.P$Y2 29.2,15 U1.P$W1 28.45,15.25 v28.3,15.1 | v28.3,15.1 27.5,15.9 27.5,17.5 27.25,17.5 C6.1 26.55,18.25 27.7,19.4 28.2,19.4 28.25,19.45 C12.1 28.7,19.75 U1.P$B1 28.8,19.9 v28.8,20.4 | U1.P$A22 34.45,20.45 34.1,20.8 33.74,20.8 C7.1 32.55,21.14 31.9,21.8 v31.7,21.8 31.7,22.7 32.5,23.5 32.9,23.9 32.9,26.9 32.9,28.5 TP_3V3.TP 29.9,29.1 TP_3.3V.TP | 35.3,12.65 35.4,12.75 35.45,12.75
  Bottom 0.152: v31.5,7.6 34.9,11 v35,11
  Bottom 0.305: v28.8,20.4 30.2,21.8 v31.7,21.8
  Power 0.152: v18.9,18.4 22.7,14.6 22.7,7.9 | 22.7,7.9 22.7,7.8 | v31.5,7.6 31.3,7.8 26.9,7.8 26.5,7.4 23.7,7.4 23.2,7.4 22.7,7.9
  Power 0.305: v31,10.9 31,11.1 28.2,13.9 28.2,15 v28.3,15.1
ALERT  (via drill 0.15)
  Top 0.1: U1.P$J24 35.95,17.75 v36.1,17.6
  Bottom 0.1: v36.1,17.6 36.8,16.9 36.8,14.1 36.8,13.9 38.2,12.5 40.8,9.9 40.8,6.5 41.9,5.4 42.8,5.4 42.94,5.4 U3.5
  other vias: 43.78,6.25
D+
  Top 0.152: D3.4 25.6,21.8 25.6,20.3 23.5,20.3 23.5,17.5 22.8,16.8 22.8,14.4 25.9,11.3 28.3,11.3 28.4,11.4 28.8,11.4 29.65,12.25 | 29.65,12.25 29.7,12.3 | 29.65,12.25 30.25,12.85 30.25,13.55 U1.P$AD6
D-
  Top 0.152: D3.6 24.65,24.65 27.25,24.65 27.85,25.25 28.6,24.5 28.6,21.6 28.5,21.5 27.5,20.5 26.3,20.5 23.9,18.1 23.9,17 23.9,16.9 23.2,16.2 23.2,14.5 23.9,13.8 24.7,13 25.3,13 25.7,12.6 26.5,11.8 28.7,11.8 29.85,12.95 29.85,13.65 U1.P$AD4
DEC1  (1 unrouted)
DEC3  (via drill 0.15)
  Bottom 0.1: v36.34,19.5 36.05,19.2 35.2,19.2 35.15,19.2 U1.P$D23
  other vias: 34.95,19
DEC4_6  (via drill 0.15)  (3 unrouted)
  Top 0.1: v31.1,21.4 31.1,20.9 30.8,20.6 30.2,20 U1.P$B5 | U1.P$E24 35.45,19.05 35.1,19.4 34.7,19.8 v34.4,19.8 | v33.8,22 33.3,22 33.2,22.1 32.76,22.1 C10.1
  Bottom 0.1: U1.P$E24 35.8,18.4 35.8,16.25 C16.1 | v32.7,21.84 32.26,21.4 v31.1,21.4 | v34.4,19.8 34.4,20.1 34,20.5 33.8,20.7 v33.8,22
  other vias: 35.45,18.75 36.1,15.96
DN
  Top 0.15: D3.1 21.6,25.2 21,25.2 21,26.3 22.25,27.55 J3.A7 22.2,28.82 22.2,29.7 23.2,29.7 23.25,29.65 J3.B7
DP  (via drill 0.35)
  Top 0.15: 22.1,23.3 D3.3
  Top 0.152: J3.A6 22.75,27.75 v23,27.5 | 22.1,23.3 21.3,23.3 20.6,24 20.6,26.6 v20.5,26.7 20.5,27.2 20.6,27.3 21.1,27.8 21.6,27.8 21.75,27.95 J3.B6
  Bottom 0.152: v23,27.5 21.3,27.5 21.2,27.4 v20.5,26.7
EPD_3V3  (via drill 0.15)
  Top 0.305: J1.15 v11.72,16.3 J1.16 12.45,16.05 12.6,15.9 12.6,14.4 12.8,14.2 13.2,14.2 13.3,14.3 13.8,14.8 14.76,14.8 16.3,13.25 EPD_C5.2 | L5.1 12.2,26.2 v13,27 13,27.9 14,28.9 Q1.3
  Bottom 0.1: C1-EP-DR.1 15.15,24.85 14.7,25.3 14.6,25.4 12.3,25.4 12.2,25.5 L5.1
  Bottom 0.305: v11.72,16.3 11,16.3 8.7,18.6 8.7,23.8 11.3,26.4 11.9,27 v13,27
  other vias: 15.15,24.3 12.2,25.9
EPD_BUSY  (via drill 0.15)
  Top 0.152: J1.9 12.35,19.55 13.4,18.5 15.2,18.5 15.5,18.2 15.5,17.4 15.6,17.3 17.5,17.3 17.9,16.9 19.2,16.9 v19.4,16.7 | U1.P$AD12 31.95,13.05 31,12.1 30.7,12.1 v30.5,12.3 | v27.1,13 28,13 v28.4,12.6
  Bottom 0.152: v19.4,16.7 19.4,17.1 20.1,17.8 21,16.9 21.2,16.7 23.6,16.7 24.3,16 24.3,14.2 24.3,13.6 24.7,13.2 26.9,13.2 v27.1,13 | v28.4,12.6 30.2,12.6 v30.5,12.3
EPD_CS  (via drill 0.15)
  Top 0.152: J1.12 12.35,18.05 13,17.4 13.1,17.3 14,17.3 14.1,17.2 14.2,17.2 14.8,16.6 14.9,16.5 14.9,16.1 18.1,16.1 18.6,15.6 19.4,15.6 v20,15 | v21,14.4 v21.9,14.4 | v23.6,15.3 24.2,15.9 v26.3,15.9
  Bottom 0.152: v20,15 20.6,14.4 v21,14.4 | v21.9,14.4 22.8,15.3 23,15.3 v23.6,15.3 | U1.P$K2 29.95,17 30,17 30,16.9 29.7,16.6 29,16.6 28.1,16.6 28,16.5 27.6,16.5 27,15.9 v26.3,15.9
  other vias: 29.45,17.5
EPD_DC  (via drill 0.15)
  Top 0.152: J1.11 12.35,18.55 12.5,18.4 13.1,17.8 13.2,17.8 13.3,17.7 14.6,17.7 14.7,17.6 14.7,17.2 15.3,16.6 15.3,16.5 16.4,16.5 18.6,16.5 v19.1,16
  Bottom 0.152: v19.1,16 20,16 20.3,15.7 21.5,14.5 21.5,12.6 21.3,12.4 21.3,11.4 24.2,8.5 27.7,8.5 28.4,9.2 28.4,10.1 28.6,10.3 29.2,10.3 31.5,10.3 31.9,10.7 32.5,11.3 32.5,12.4 32.5,12.7 U1.P$AD10
  other vias: 31.45,13.75
EPD_RST  (via drill 0.15)
  Top 0.152: J1.10 12.35,19.05 13.2,18.2 13.3,18.1 14.8,18.1 15.1,17.8 15.1,17.3 15.5,16.9 16.2,16.9 v17.2,16.9 | v16.9,14.4 16.9,13 17.6,12.3 20.6,12.3 20.8,12.5 22.4,12.5 v23.2,13.3
  Bottom 0.152: v17.2,16.9 17.2,14.7 v16.9,14.4 | v23.2,13.3 23.2,11.6 24.1,10.7 29.9,10.7 31,11.8 31,13 30.95,13.05 | 30.95,13.05 v30.9,13.1 | U1.P$AC11 30.95,13.5 30.95,13.05
  other vias: 31.7,14.25
GDR
  Top 0.1: Q3.1 10.25,28.15 10.7,27.7 10.7,25.7 10.5,25.5 10.88,25.12 R2_EP_DR.2 11.1,23.5 11,23.4 11.35,23.05 J1.2
GND  (via drill 0.15)  (18 unrouted)
  Top 0.1: IC3.9 IC3.8 | J3.SH3 26.25,28.77 J3.A1_B12 | C22.2 v36.86,26.05 v36.85,26.05 | C11.2 v36.9,19.5 | C9.2 v36.5,18.6 | J2.3 J2.5 | U3.9 42.05,6.25 U3.4 41.81,4.12 41.2,3.5 | U3.9 42.8,7.1 42.3,7.6 42.2,7.6 42.05,7.75 U3.1 42.35,7.75 42.9,8.3 43.25,8.65 C27.2 | U3.6 43.05,6.75 U3.9 | C29.2 35.4,5.35 v35.4,4 SW_ENT.1 | C20.2 27.25,8.5 27.23,8.47 | 27.23,8.47 C14.2 | C21.2 26.68,8.47 27.23,8.47 | J3.SH4 18.73,29.35 J3.A12_B1
  GND 0.1: J1.17 11.72,15.53 11.7,15.5 | EPD_C5.1 17.36,13.1 EPD_C10.1 | J2.3 41,15.65 41,14.4 41.1,14.4 42.8,12.7 42.8,8.8 | R2_USB.2 19.15,26.38 R1_USB.1 | IC1.D2 28.4,26.1 29.3,27 29.35,26.95 | TP_GND.TP 8.9,24.8 8.9,24.4 | C4.2 36.14,26.86 36.9,26.1 v36.85,26.05 34.6,23.8 | X1.2 34.85,23.8 34.6,23.8 | X1.4 34.33,24.07 34.6,23.8 | C3.2 37.36,19.95 v36.9,19.5 36.5,19.1 36.5,18.8 | 36.5,18.8 36.5,18.7 | 36.5,18.7 v36.5,18.6 36.5,18.7 | 36.5,18.8 36.5,18.7 | J1.MP2 9.07,9.47 8.9,9.3 9.45,8.75 | C24.1 16.6,19.45 | 16.6,19.45 16.6,19.4 16.6,19.45
  other vias: 11.72,15.55 11.72,20.05 9.07,11.26 8.25,7.18 10.7,6.38 13.76,6.9 13.35,5.5 13.7,3.98 15.66,5.5 17.3,6.3 18.3,6.3 16.85,8.2 15.85,9.4 15.55,11 15.55,11 16.3,12.04 18.25,13.1 18.25,13.1 19.35,11.5 20.55,10.1 22.05,13.3 20.75,16.3 18.1,20.4 18.1,20.8 18.25,23 16.45,24.3 23.55,21.6 40.97,15.68 40.97,15.68 18.4,26.38 19.3,26.52 19.6,22.88 21.85,24 27.7,26.1 28.4,18.95 6.7,27 11.1,25.68 26.82,29.35 35.3,26.86 35.73,22.93 34.27,24.07 33.45,23.1 32.6,22.45 33.4,21.66 31.55,24 32.05,25.7 37.36,20.7 34.95,18.5 42.6,3.6 25.25,9.9 23.85,6 24.4,3.97 15.25,20.8 16.15,18 16.65,19.4 13.6,21.05 28.2,17.75 28.1,16.14 27.75,14.2 36.1,15.45
  pour GND: -5.9,41 41.7,41 49.2,33.5 49.2,-3.2 46.7,-5.7 -5.2,-5.7 -5.5,-5.4
HAPTIC_EN  (via drill 0.15)
  Top 0.1: IC2.A1 17.8,7.3 18.4,7.3 18.9,7.8 v18.9,7.9 | v21.8,9.5 23.7,11.4 v23.9,11.4
  Bottom 0.1: v18.9,7.9 18.9,8.1 19.3,8.5 19.8,9 20.4,9 20.6,9 20.8,9.2 21.1,9.5 v21.8,9.5 | v23.9,11.4 24.1,11.4 24.4,11.1 26.2,11.1 26.3,11.2 27.9,11.2 28.1,11.4 28.1,12.1 28.1,12.6 28.2,12.7 28.4,12.9 28.6,12.9 29.1,12.9 29.2,13 29.2,14.5 29,14.7 28.95,14.75 U1.P$U1
  other vias: 28.95,15.75
IMU_INT1  (via drill 0.15)
  Top 0.1: IC3.5 9.75,6.15 9.8,6.2 10.3,6.7 v10.3,6.9 | v17.5,8.7 18.8,8.7 19,8.7 v19.3,9 | v21.7,10.7 22.9,11.9 23,12 23.2,12 23.8,12.6 23.9,12.7 v24,12.7 | v28.6,15.7 28.6,16.4 U1.P$N1
  Bottom 0.1: v10.3,6.9 10.6,7.2 11.9,7.2 12,7.2 12.5,7.7 14.2,7.7 14.3,7.6 14.8,7.6 14.9,7.7 14.9,8.5 15.1,8.7 v17.5,8.7 | v19.3,9 19.6,9.3 20.3,9.3 v21.7,10.7 | v24,12.7 25.9,12.7 26,12.8 26.1,12.9 26.7,12.9 26.9,12.7 27,12.6 27.1,12.6 27.6,13.1 27.6,13.3 27.6,13.4 28.6,14.4 v28.6,15.7
IMU_INT2  (via drill 0.15)
  Top 0.1: v11.5,7.7 12,8.2 13.6,8.2 14.4,8.2 15.2,9 15.2,10.1 15.3,10.2 15.5,10.2 18.2,10.2 18.7,10.7 18.8,10.8 21.3,10.8 21.8,11.3 21.8,11.9 22.1,12.2 22.8,12.2 v23.6,13 | v23.8,14.6 24.1,14.9 24.1,15.2 24.3,15.4 25.9,15.4 v27.3,15.4
  Bottom 0.1: IC3.6 9.03,6.9 9.7,6.9 9.7,7.6 9.8,7.7 10.6,7.7 v11.5,7.7 | v23.6,13 23.6,14.4 v23.8,14.6 | v27.3,15.4 28,16.1 28,16.2 28.7,16.2 29.15,16.2 U1.P$P2
  other vias: 8.78,6.65 29.45,16.5
LX1  (2 unrouted)
  Top 0.1: IC9.B3 19.4,20.8 20.2,20
LX2
  Top 0.1: L7.2 22.63,19.23 22.4,19 21.6,18.2 21,18.2 20.6,18.2 19.6,18.2 19.6,19.6 19.5,19.7 19.2,20 IC9.D3 IC9.D2
MOSI  (via drill 0.15)
  Top 0.152: v27,22.7 25.8,22.7 v25.7,22.8 | v12.5,16.6 12.05,17.05 J1.14
  Bottom 0.152: U1.P$B13 32.2,20.5 32,20.7 30.9,20.7 30.25,20.05 30.2,20 27.5,22.7 v27,22.7 | v25.7,22.8 25.2,22.3 24.4,22.3 21.1,22.3 21,22.4 19.8,23.6 18,23.6 17.4,23 17.4,21.9 17.1,21.6 14.9,21.6 14.4,21.1 14.4,20.2 13.8,20.2 12.5,18.9 v12.5,16.6
  other vias: 32.2,19.75
N$1
  Top 0.1: IC1.D1 27.3,25.4 27.4,25.3 27.23,25.12 R9.2
N$3
  Top 0.152: U1.P$H23 35.25,18.3 35.8,18.3 35.9,18.4 35.9,20 36.6,20.7 C3.1 36.6,20.95 36.6,25.1 36.4,25.3 L1.1
N$4  (via drill 0.15)
  Top 0.1: L2.2 30.4,9.4 31.4,9.4 32.2,10.2 v32.2,10.3
  Bottom 0.1: v32.2,10.3 33.1,11.2 33.2,11.2 33.3,11.3 L3.1
  other vias: 33.3,11.9
N$5  (via drill 0.15)
  Top 0.1: R4.2 21.18,17.23 20.5,17.9 19.9,17.9 19.5,17.9 19.35,18.05 | 19.35,18.05 19.3,18.1 | 19.35,18.05 19.2,18.2 v19.2,18.6
  Bottom 0.1: v19.2,18.6 19.2,19 19.2,19.2 18.6,19.8 18.4,20 IC9.D1
  other vias: 18.1,20
N$6  (via drill 0.15)
  Top 0.1: X1.1 34.27,21.73 C1.1
  Bottom 0.1: U1.P$B24 35.45,19.95 34.3,21.1 34.14,21.25 C1.1
  other vias: 35.45,19.75 34.14,21.6
N$7
  Top 0.1: U1.P$A23 34.95,20.61 C2.1 35,21.34 35,21.7 35,23.9 35.12,24.02 35.67,24.02 | X1.3 35.67,24.02 | 35.67,24.02 35.55,23.9
N$8  (via drill 0.15)  (1 unrouted)
  Bottom 0.1: IC9.E1 18.2,19.5 18.2,18
  other vias: 18.1,19.6
N$9  (via drill 0.15)
  Top 0.1: v31.3,9.9 31.3,10.2 31.6,10.5 31.9,10.8 v31.9,11.6 | v31.4,13.1 31.1,13.4 v30.6,13.4
  Bottom 0.1: C20.1 31,9.05 31,9.7 31.2,9.9 v31.3,9.9 | v31.9,11.6 31.9,12.6 v31.4,13.1 | v30.6,13.4 30.6,13.9 30.6,14.2 30.55,14.25 U1.P$AC5
  other vias: 30.45,8.5 30.2,14.25
N$10  (via drill 0.15)
  Top 0.1: Q3.3 11.7,27.15 11.7,26.4 11.7,25.5 11.8,25.4 12.1,25.1 12.5,25.1 13.2,25.8 L5.2 13.8,25.9 14.6,25.1 14.4,24.9 14.4,22.7 15,22.1 16.7,22.1 16.75,22.15 | 16.75,22.15 16.85,22.25 C2-EP-DR.2 | D5.2 13.9,13.05 14.05,13.2 14.3,13.2 v15,12.5 | v17.4,19.1 17.2,19.3 17.2,21.2 17.2,21.7 16.75,22.15
  Bottom 0.1: v15,12.5 15.8,13.3 15.8,14.2 15.8,17.5 v17.4,19.1
N$11
  Top 0.1: 35.5,16.7 U1.P$N24 35.95,16.75 36.2,17 36.5,17.3 36.5,17.6 C9.1
N$12  (via drill 0.15)  (1 unrouted)
  Bottom 0.1: U1.P$A18 33.1,20.6 33.1,22.1 33.1,22.64 v32.84,22.9
  other vias: 33.45,20.25
N$13  (via drill 0.15)
  Top 0.1: v14.9,10.5 14.7,10.3 v14.4,10.3
  Bottom 0.1: J1.19 13.38,12.9 13.4,12.9 13.5,12.8 13.5,10.3 14.1,10.3 v14.4,10.3 | v14.9,10.5 15.2,10.2 15.6,10.2 15.7,10.1 16.8,10.1 17.15,9.75 EPD_C7.2
  other vias: 11.72,14.55 17.15,9.4
N$15  (via drill 0.15)  (1 unrouted)
  Top 0.1: v13.8,23.6 13.6,23.8 D4.2 | v14.6,21.9 14.6,19.1 v14.7,19
  Bottom 0.1: v13.8,23.6 14.6,22.8 C2-EP-DR.1 14.65,21.9 v14.6,21.9 | v14.7,19 14.7,17.9 14.3,17.5 14.2,17.4 14.2,17.1 14.2,16.3 14.1,16.2 13.9,16 13.9,15.9 v13.9,15.95
  other vias: 15.55,22.8 15.55,22.8
N$17
  Top 0.1: SJ1.2 10.29,9.32 10.29,9.43 | 10.29,9.43 R_TYPE_SEL.2 | R1_EP_DR.1 9.57,30.38 8.9,29.7 8.1,28.9 8.1,26.1 8.1,26 8.1,24.9 8.3,24.7 8.3,23.7 8.3,20.3 9.8,18.8 10.29,18.31 10.29,9.43
N$18  (via drill 0.15)
  Top 0.1: v9.4,5 10.22,5.82 R3.2
  Bottom 0.1: IC3.1 7.8,5.07 7.8,5 v9.4,5
  other vias: 7.25,5.62
N$19  (via drill 0.15)
  Bottom 0.1: C32.1 16.25,7.5 16.8,7.5 17.1,7.5 IC2.A2
  other vias: 15.55,8.2 17.8,6.8 15.55,8.2
N$21  (via drill 0.15)
  Top 0.1: J1.4 11.68,22 10.7,22 10.4,21.7 10.4,19.2 10.6,19 11,18.6 v11,17 | EPD_C2.2 13.7,15.4 v13.3,15
  Bottom 0.1: v11,17 11.5,17 12.4,16.1 12.9,15.6 12.9,14.8 13,14.7 v13.3,15
N$22  (1 unrouted)
N$25  (via drill 0.15)  (1 unrouted)
  other vias: 29.2,9.6
N$33  (via drill 0.15)
  Top 0.1: v14,14.3 14.7,14.3 15.1,13.9 15.8,13.2 15.8,11.7 16.85,11.7 EPD_C6.2
  Bottom 0.1: J1.18 12.25,15.05 12.8,14.5 13.2,14.1 13.8,14.1 v14,14.3
  other vias: 11.72,15.05
N$34  (via drill 0.15)
  Top 0.1: J1.20 12.35,14.05 12.7,13.7 12.9,13.7 13.6,13.7 13.7,13.6 13.8,13.5 14.4,13.5 14.5,13.5 v15,13 | v15.6,14.6 15.9,14.6 v16.3,14.2 | v17.5,15.3 18.4,15.3 v18.5,15.2
  Bottom 0.1: v15.6,14.6 15.6,13.6 v15,13 | v16.3,14.2 16.6,13.9 17.4,13.9 17.5,14 v17.5,15.3 | v18.5,15.2 18.8,15.5 18.8,16.4 20.1,16.4 21.95,16.4 EPD_C8.2
  other vias: 22.05,16.3
N$37  (via drill 0.15)
  Top 0.1: J1.22 12.5,13.05 12.5,10.9 13.7,10.9 14.8,12 v15.1,12 | v17.1,12.3 17.6,11.8 18.3,11.8 v18.4,11.9
  Bottom 0.1: v15.1,12 15.8,12 16.1,12.3 v17.1,12.3 17.2,12.2 17.3,12.2 | v18.4,11.9 19.3,12.8 19.4,12.8 19.55,12.95 EPD_C10.2
  other vias: 19.55,13.1
N$39  (via drill 0.15)  (1 unrouted)
  Top 0.1: v12.9,11.6 v13.9,11.6 | v14.1,10.8 14.6,11.3 v14.9,11.3 | v18.5,11.2 18.25,11.45 v17.55,11.45
  Bottom 0.1: J1.24 12.45,12.05 v12.9,11.6 | v13.9,11.6 14.1,11.4 v14.1,10.8 | 17.9,11.4 17.95,11.45 | v18.5,11.2 19,10.7 19,10.2 19.1,10.1 EPD_C12.2 | v14.9,11.3 15.2,11 15.2,10.6 15.3,10.5 15.5,10.5 17.4,10.5 17.55,10.65 v17.55,11.45
  other vias: 11.72,12.05 19.25,10.1
N$41
  Top 0.1: J3.B5 20.75,28.15 20.2,27.6 19.68,27.07 R2_USB.1
N$42  (via drill 0.15)  (1 unrouted)
  Power 0.1: J3.A5 23.75,26.85 23.5,26.6 22.7,25.8 18.6,25.8 v18.4,25.8
  other vias: 23.75,28.77
OUT+  (1 unrouted)
  Top 0.1: IC2.A3 19.3,7.8 20.8,7.8
OUT-  (via drill 0.15)  (1 unrouted)
  Top 0.1: v18.4,4.4 17.9,3.9 17.9,3.4
  Bottom 0.1: IC2.C3 18.4,5.7 v18.4,4.4
  Power 0.1: IC2.C3 18.4,5.7
  other vias: 18.3,5.8
P0.00  (via drill 0.15)  (1 unrouted)
  Top 0.1: U1.P$D2 29.15,18.7 28.8,18.7 28.7,18.6 28.6,18.6 28.55,18.6 C17.2 28.05,18.1 v27.4,18.1
  Power 0.1: v27.4,18.1 26.6,17.3 v26.1,17.3
P0.01  (2 unrouted)
P0.13  (via drill 0.15)
  Top 0.1: SW_UP.2 11.3,4.38 11.3,5.2 11.6,5.5 C30.1 11.8,5.75 v11.8,6.5 | v13.1,7.4 16.7,7.4 17,7.1 17.55,7.65 17.55,7.85 17.5,7.9 17.95,8.35 18,8.3 19.9,8.3 23.8,12.2 v24.1,12.2 | v26.43,13.5 26.6,13.32 v26.6,12.5 | v29.5,13.3 29.4,13.3 29.1,13.6 27.7,13.6 v27.5,13.4
  Bottom 0.1: v11.8,6.5 12.7,7.4 v13.1,7.4 | v24.1,12.2 24.2,12.3 25.6,12.3 26.4,12.3 v26.6,12.5 | 30.9,13.8 U1.P$AD8 30.9,13.8 | 30.9,13.8 30.9,14.5 30.8,14.6 30.6,14.6 30,14.6 29.7,14.3 29.7,14.1 29.7,13.5 v29.5,13.3 | v27.5,13.4 27.3,13.4 26.8,13.9 26.7,13.9 26.4,13.6 26.4,13.53 v26.43,13.5
  other vias: 30.95,13.75
P0.14  (via drill 0.15)
  Top 0.1: v34.4,12.6 34.3,12.5 32.9,12.5 32.8,12.4 32.8,10.2 32.8,10.18 32.06,9.44 | 32.06,9.44 R8.1 31.62,9 31.2,9 31.2,8.7 31.2,8 30.9,7.7 30.8,7.6 29.2,7.6 28.6,7.6 28.4,7.8 26.1,7.8 26,7.7 25.3,7 v25,7 | SW_ENT.2 32.6,4.5 33,4.9 33,5.5 v32.7,5.8 | v32.3,7.2 32.3,7.9 32.4,8 32.4,9.1 32.06,9.44
  Bottom 0.1: U1.P$AC9 31.2,14.5 31.4,14.7 31.7,14.7 31.9,14.5 32.7,14.5 32.8,14.5 33.8,13.5 34.4,12.9 v34.4,12.6 | v25,7 23.55,7 C31.1 | v32.7,5.8 32.7,6.5 32.5,6.7 32.3,6.9 v32.3,7.2
  other vias: 31.2,14.25 22.55,6
P1.01  (via drill 0.15)  (1 unrouted)
  Bottom 0.1: U1.P$Y23 36.08,15 R_PWR_EPD.1
  other vias: 34.95,15 36.1,14.97
P1.02  (via drill 0.15)
  Top 0.1: SW_DN.2 21.6,5 21.7,5.1 24.7,5.1 25.1,4.7 26.1,3.7 28.1,3.7 28.6,4.2 28.6,4.9 30,6.3 30.1,6.3 33.15,6.3 C29.1 34.55,6.7 34.6,6.7 35.4,7.5 35.4,8.5 35.4,8.8 35,9.2 35,9.8 35.2,10 35.2,10.1 35.15,10.15 35.8,10.8 36.12,11.12 R7.1 36,12.22 36,12.6 v36,12.7
  Bottom 0.1: v36,12.7 35.5,13.2 35.5,13.7 34.4,14.8 34.85,15.25 U1.P$W24
  other vias: 35.45,15.25
PMIC_INT  (1 unrouted)
PREVGH  (via drill 0.15)
  Top 0.1: D5.1 12.55,10.5 11.5,10.5 10.8,11.2 10.8,11.4 10.8,13.3 10.9,13.4 11.05,13.55 J1.21 12.45,13.55 12.6,13.4 12.7,13.3 v13.2,13.3 | v14.2,13.9 14.6,13.9 14.9,13.6 15.4,13.1 v15.4,12.5 | v17.4,13.5 17.6,13.7 17.7,13.7 17.8,13.8 17.8,13.9 18.7,13.9 19.25,14.45 EPD_C9.2
  Bottom 0.1: v13.2,13.3 13.8,13.9 v14.2,13.9 | v15.4,12.5 16.1,13.2 16.8,13.2 17.1,13.2 v17.4,13.5
PREVGL  (via drill 0.15)  (1 unrouted)
  Top 0.1: D2.2 13.15,19.55 v12.8,19.9 | v9.4,18.6 9.1,18.3 9.1,17 9.1,13.1 v9.5,12.7
  Bottom 0.1: v12.8,19.9 10.6,19.9 9.5,18.8 9.4,18.7 v9.4,18.6 | v9.5,12.7 11.4,12.7 11.6,12.5 11.68,12.5 J1.23
  other vias: 11.72,12.55
RESE
  Top 0.1: R1_EP_DR.2 10.03,29.82 8.8,28.6 8.8,28 Q3.2
RESET  (via drill 0.15)  (1 unrouted)
  Top 0.1: v37.5,11.5 41.2,11.5 41.5,11.8 41.7,12 41.7,14.1 42.01,14.41 J2.6 | v9.2,25.4 10.5,24.1 10.5,23.9 10.5,23 11,22.5 11.68,22.5 J1.3
  Bottom 0.1: U1.P$AC13 34.95,11.5 v37.5,11.5 | TP_RESET.TP 14.3,29.7 13.3,28.7 10.9,28.7 10.4,29.2 9,29.2 8.8,29 8.8,25.8 v9.2,25.4
  other vias: 32.2,14.25 14.3,31
RF
  Top 0.152: L1.2 34.1,26 34.85,26 34.95,26 C4.1 35.8,25.84 36.09,25.84 C22.1 36.34,28.05 36.5,28.2 39.2,30.9 ANT1.1
SCK  (via drill 0.15)
  Top 0.152: U1.P$A12 31.9,20.3 v31.9,21 | v30.6,20.9 30.5,21 30.5,21.5 v29.3,21.5 | v28.2,22.5 28.2,22.2 27.8,21.8 26.9,20.9 26.1,20.9 26,21 v26,22.1 | v20.5,21.9 19.1,21.9 v18.8,22.2 | J1.13 12.25,17.55 12.35,17.55 13,16.9 v13.9,16.9
  Bottom 0.152: v31.9,21 30.7,21 v30.6,20.9 | v29.3,21.5 28.3,22.5 v28.2,22.5 | v26,22.1 25.6,21.7 25,21.7 21.9,21.7 21.7,21.9 20.7,21.9 v20.5,21.9 | v18.8,22.2 18.2,22.2 17.3,21.3 16,20 15.3,20 13.9,18.6 v13.9,16.9
  other vias: 31.95,20.25
SCL  (via drill 0.15)
  Top 0.152: v6.6,5.8 6.95,6.15 IC3.12 | v44.3,5.3 44.3,5.5 44.6,5.8 44.6,7.2 44.55,7.25 U3.7 | v16.3,5.4 16.7,5.8 IC2.C1 | v20,5.1 R17.2 | v29.5,7 29,6.5 TP_SCL.TP | v22.5,17.9 22.38,17.77 R4.1 | v26.1,27.1 26.3,26.9 IC1.B1
  Bottom 0.152: U1.P$M2 24.5,17 23.45,18.05 | 23.45,18.05 23.15,18.35 | 23.15,18.35 19.4,22.1 14.55,17.25 14.55,7.85 14.55,7.95 | 14.55,7.95 14.55,8 11.2,8 10.7,8 5.9,8 5.4,7.5 5.4,7 v6.6,5.8 6.6,3.7 6.85,3.45 | 14.55,7.95 14.4,8.1 | 7.4,4 7.2,3.8 | 6.85,3.45 7.2,3.8 | 6.85,3.45 6.7,3.3 | 7.2,3.8 7.4,4 | 7.4,4 15.3,4 | 15.3,4 19.9,4 | 19.9,4 27.8,4 29,4 | 29,4 34.9,4 | 34.9,4 35.5,4 | 34.9,4 43,4 v44.3,5.3 | 15.3,4 16.3,5 v16.3,5.4 | 19.9,4 20,4.1 v20,5.1 | 29,4 29.5,4.5 v29.5,7 | 23.15,18.35 22.95,18.35 v22.5,17.9 | 23.45,18.05 23.45,18.95 25.5,21 26.1,21.6 v26.1,27.1
  other vias: 29.45,17
SDA  (via drill 0.15)
  Top 0.152: v26.5,26.1 26.9,26.5 IC1.C1 | v21.1,21.5 20.8,21.2 19.8,21.2 v19.8,21.1 | v19,17.5 18.8,17.5 18.65,17.65 18.52,17.43 R2.1 | v25.6,5.2 25.6,5.53 R18.2 | v29,4.5 29.9,4.5 TP_SDA.TP 30.7,5.3 v32.5,5.3 | v8,6.4 7.75,6.15 IC3.2 | v44.5,8.2 44.05,7.75 U3.8
  Bottom 0.152: U1.P$L1 26.9,19.3 | 26.9,19.3 26.4,19.8 26.4,21.5 26.4,22.2 26.5,22.3 v26.5,26.1 | 26.9,19.3 23.3,19.3 v21.1,21.5 | v19.8,21.1 19.8,18.3 v19,17.5 17.9,16.4 v17.9,7.7 18.1,7.5 18.1,6.7 18.1,6.6 IC2.B2 | IC2.B2 19.7,6.3 20.4,5.6 20.8,5.2 v25.6,5.2 26.4,4.4 26.5,4.4 26.6,4.5 v29,4.5 | IC2.B2 17.6,6.1 14.8,6.1 11.6,6.1 11.5,6 10.35,4.85 | 10.35,4.85 10.3,4.8 | 10.35,4.85 8.8,6.4 v8,6.4 | v32.5,5.3 36.9,5.3 37.9,6.3 40.5,6.3 41.9,4.9 43.1,4.9 44.8,6.6 44.8,7.7 44.7,7.8 44.5,8 v44.5,8.2
  other vias: 28.95,17.25 17.8,6.3
SWDCLK  (via drill 0.15)  (1 unrouted)
  Top 0.1: v38.3,9.7 38.3,8.5
  Bottom 0.1: v42.23,15.68 40.88,15.68 40.3,15.1 39.95,14.75 U1.P$AA24 38.3,11.9 38.3,11.5 v38.3,9.7
  other vias: 35.45,14.75
SWDIO  (via drill 0.15)
  Top 0.1: J2.2 41.58,16.3 40.6,16.3 37.5,16.3 37.1,15.9 v37.1,12.6 37.1,10.3 TP_SWDIO.TP | U1.P$AC24 35.45,13.25 v35.4,13.2 | v35.7,11.9 v35.7,11.4
  Bottom 0.1: v37.1,12.6 U1.P$AC24 | v35.4,13.2 35.1,12.9 35.1,11.9 v35.7,11.9 | v35.7,11.4 36.6,10.5 v36.6,9.7
  other vias: 35.45,14.25 35.45,14.25
SWO  (via drill 0.15)
  Top 0.1: v34.8,12.5 34.8,11.9 34.8,11.5 34.6,11.3 34.2,10.9 33.8,10.5 TP_SWO.TP
  Bottom 0.1: U1.P$AD22 34.8,13.4 v34.8,12.5
  other vias: 34.45,13.75
VBAT  (via drill 0.35)
  Top 0.15: v28.8,25.3 28.7,25.3 28.1,25.9 | 28.4,25.9 27.8,26.5 IC1.C2
  Top 0.152: TP_VBAT.TP 37.7,4.7 v36.8,4.7 37.3,5.2 40.33,5.2 40.26,6.65 41.72,6.65 U3.3 U3.2 41.35,7.25 40.8,7.8 41.8,8.8 C27.1 | C37.2 29.45,25.9 28.4,25.9 28.1,25.9
  Power 0.508: v36.8,4.7 36.8,7 29.8,14 29.8,25.3 v28.8,25.3
VBUS  (via drill 0.15, 0.35)  (1 unrouted)
  Top 0.1: v23.8,29.7 24.48,29.7 24.9,29.27 J3.A4_B9
  Top 0.15: v29.3,23.8 29.3,24.25 C38.1 31.55,26.5 31.55,27.45 30.6,28.4 28.8,28.4 IC1.A2
  Top 0.152: D3.5 27.1,24 v27.2,24.1 27.64,23.66 C42.1 27.64,22.45 v26.9,21.7 | U1.P$AD2 29.15,14.05 28.65,14.05 v28.5,14.2
  Top 0.305: v24.5,11.6 24.5,10.45 C21.1
  Top 0.508: J3.A4_B9 v24.9,26.9
  Bottom 0.1: J3.A9_B4 20.1,27.9 20.2,27.8 20.5,27.8 22.6,27.8 22.8,28 23.1,28.3 23.1,29.5 23.3,29.7 v23.8,29.7
  Bottom 0.305: v28.5,14.2 25.9,11.6 v24.5,11.6
  Power 0.305: v28.5,14.2 28.1,14.2 27.1,15.2 27.1,17.2 28.9,19 27.7,20.2 26.9,21 v26.9,21.7
  Power 0.508: v24.9,26.9 25.4,27.4 25.4,25.7 27,24.1 v27.2,24.1 29,24.1 v29.3,23.8
  other vias: 20.1,28.77
VREG  (via drill 0.15)  (2 unrouted)
  Top 0.1: IC9.A1 IC9.A2 IC9.A3 19.2,21.5 19.4,21.5 20.3,21.5 20.6,21.5 20.9,21.8 21.05,21.95 | C39.1 21.7,21.6 21.2,22.1 | 21.2,22.1 21.05,21.95 | TP_VREG.TP 27.7,31.1 27.7,28.9 v27.9,28.7 | 19.8,21.95 21.05,21.95 | C23.2 19.36,22.4 19.4,22.4 20.9,22.4 21.2,22.1
  Bottom 0.1: IC9.A1 17.7,20.8 v16.5,20.8 | v27.9,28.7 27.9,28.3 28.5,27.7 28.6,27.6 28.6,27 28.5,26.9 IC1.B2
  other vias: 18.1,21.2 27.7,26.9